# EAGLE design electron_v011 (EAGLE 7.2.0)

## Sheet 1 of 4
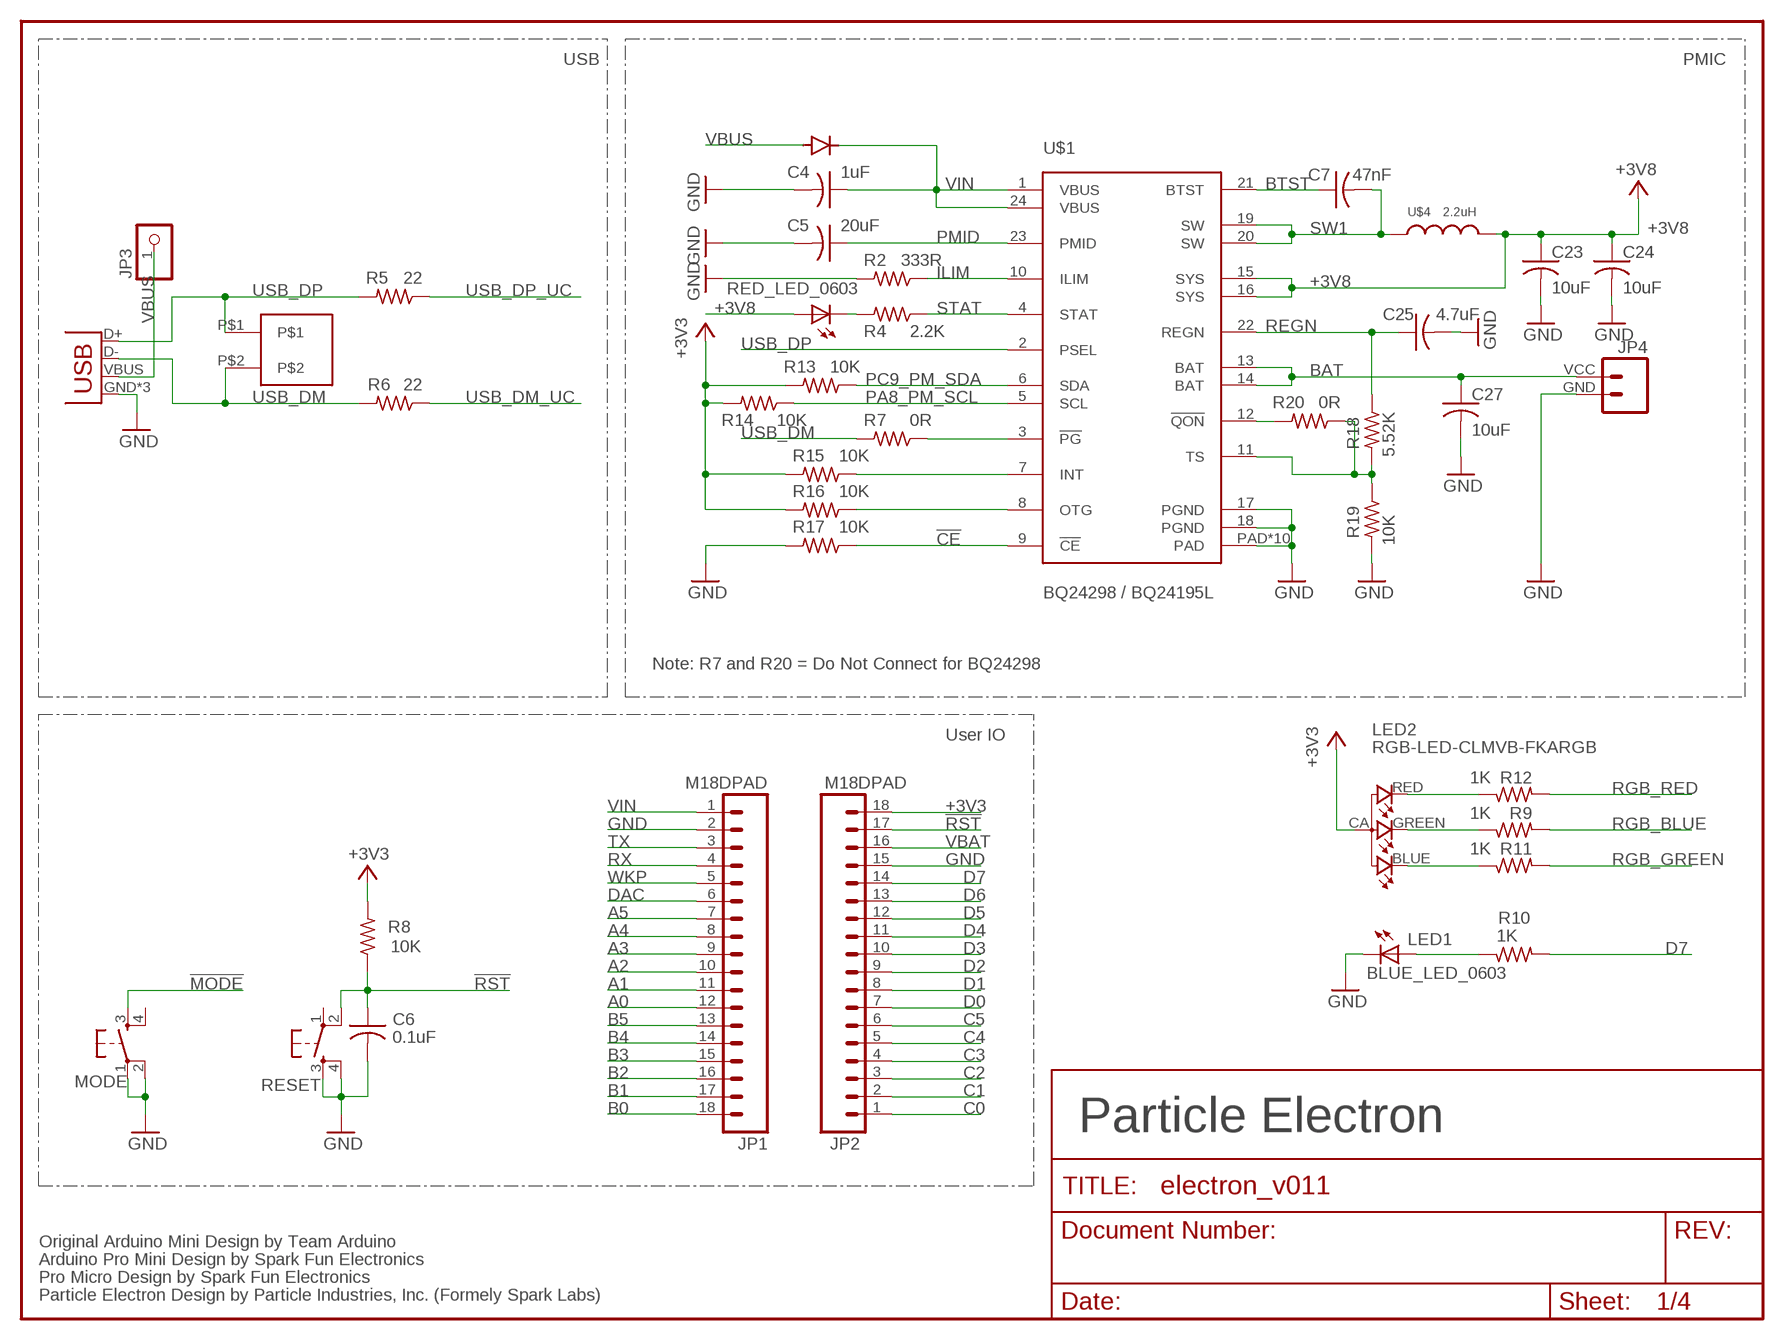
[diagram p0: schematic, sheet 1]

### Parts
BLUE_LED_0603  LED0603  [LED-0603]
C4  1uF  C-US0603  [C0603_B]
C5  20uF  C-US0603  [C0603_B]
C6  0.1uF  C-US  [C0402_B]
C7  47nF  C-US  [C0402_B]
C23  10uF  C-US0603  [C0603_B]
C24  10uF  C-US0603  [C0603_B]
C25  4.7uF  C-US0603  [C0603_B]
C27  10uF  C-US0603  [C0603_B]
JP1  M18DPAD  [1X18-D-PADS]
JP2  M18DPAD  [1X18-D-PADS]
JP3  PINHD-1X1  [1X01]
JP4  M024UCON-15767  [JST-2-SMD-VERT]
LED2  RGB-LED-CLMVB-FKARGB  [PLCC4-2MM-RGB]
MODE  KMR211GLFS  TAC_SWITCHSMD  [TACTILE_SWITCH_SMD]
R2  333R  R-US_  [R0402_B]
R4  2.2K  R-US_  [R0402_B]
R5  22  R-US_  [R0402_B]
R6  22  R-US_  [R0402_B]
R7  0R  R-US_  [R0402_B]
R8  10K  R-US_  [R0402_B]
R9  1K  R-US_  [R0402_B]
R10  1K  R-US_  [R0402_B]
R11  1K  R-US_  [R0402_B]
R12  1K  R-US_  [R0402_B]
R13  10K  R-US_  [R0402_B]
R14  10K  R-US_  [R0402_B]
R15  10K  R-US_  [R0402_B]
R16  10K  R-US_  [R0402_B]
R17  10K  R-US_  [R0402_B]
R18  5.52K  R-US_  [R0402_B]
R19  10K  R-US_  [R0402_B]
R20  0R  R-US_  [R0402_B]
RED_LED_0603  LED0603  [LED-0603]
RESET  KMR211GLFS  TAC_SWITCHSMD  [TACTILE_SWITCH_SMD]
U$1  BQ24298 / BQ24195L  BQ24298RTWR  [QFN24]
U$3  DIODE  [DIODE-DO-220AA(SMP)]
U$4  2.2uH  INDUCTORH  [INDUCTOR-4020]
U$7  M02_0.05_HEADER  [M02_0.05_HEADER]
X1  USB-MICROB  USBUSB-MICROB-SLOT-HOLE  [USB-MICROB-SLOT-HOLE]

### Nets
!CE: R17.1 U$1.9(!CE)
!MODE: MODE.3 ; also sheet 2
!RST: C6.1 JP2.17 R8.1 RESET.2 ; also sheet 2
+3V3: JP2.18 LED2.CA R8.2 R13.2 R14.2 R15.2 R16.2 ; also sheet 2,3,4
+3V8: C23.1 C24.1 RED_LED_0603.A U$1.15(SYS) U$1.16(SYS) U$4.P$2 ; also sheet 3,4
A0: JP1.12 ; also sheet 2
A1: JP1.11 ; also sheet 2
A2: JP1.10 ; also sheet 2
A3: JP1.9 ; also sheet 2
A4: JP1.8 ; also sheet 2
A5: JP1.7 ; also sheet 2
B0: JP1.18 ; also sheet 2
B1: JP1.17 ; also sheet 2
B2: JP1.16 ; also sheet 2
B3: JP1.15 ; also sheet 2
B4: JP1.14 ; also sheet 2
B5: JP1.13 ; also sheet 2
BAT [BAT]: C27.1 JP4.VCC U$1.13(BAT) U$1.14(BAT) ; also sheet 4
BTST: C7.1 U$1.21(BTST)
C0: JP2.1 ; also sheet 2
C1: JP2.2 ; also sheet 2
C2: JP2.3 ; also sheet 2
C3: JP2.4 ; also sheet 2
C4: JP2.5 ; also sheet 2
C5: JP2.6 ; also sheet 2
D0: JP2.7 ; also sheet 2
D1: JP2.8 ; also sheet 2
D2: JP2.9 ; also sheet 2
D3: JP2.10 ; also sheet 2
D4: JP2.11 ; also sheet 2
D5: JP2.12 ; also sheet 2
D6: JP2.13 ; also sheet 2
D7: JP2.14 R10.2 ; also sheet 2
DAC: JP1.6 ; also sheet 2
GND: BLUE_LED_0603.C C4.2 C5.2 C6.2 C23.2 C24.2 C25.2 C27.2 JP1.2 JP2.15 JP4.GND MODE.1 MODE.2 R2.2 R17.2 R19.2 RESET.3 RESET.4 U$1.17(PGND) U$1.18(PGND) U$1.PAD U$1.PAD@1(PAD) U$1.PAD@2(PAD) U$1.PAD@3(PAD) U$1.PAD@4(PAD) U$1.PAD@5(PAD) U$1.PAD@6(PAD) U$1.PAD@7(PAD) U$1.PAD@8(PAD) U$1.PAD@9(PAD) X1.GND X1.MT1(GND) X1.MT2(GND) ; also sheet 2,3,4
ILIM: R2.1 U$1.10(ILIM)
LED1: BLUE_LED_0603.A R10.1
N$1: R20.2 U$1.12(!QON)
N$2: R7.1 U$1.3(!PG)
N$6: R4.2 RED_LED_0603.C
N$7: R16.1 U$1.8(OTG)
N$9: R15.1 U$1.7(INT)
N$27: LED2.BLUE R11.1
N$29: LED2.GREEN R9.1
N$54: LED2.RED R12.1
PA8_PM_SCL: R14.1 U$1.5(SCL) ; also sheet 2,4
PC9_PM_SDA: R13.1 U$1.6(SDA) ; also sheet 2,4
PMID: C5.1 U$1.23(PMID)
REGN: C25.1 R18.1 U$1.22(REGN)
RGB_BLUE: R11.2 ; also sheet 2
RGB_GREEN: R9.2 ; also sheet 2
RGB_RED: R12.2 ; also sheet 2
RX: JP1.4 ; also sheet 2
STAT: R4.1 U$1.4(STAT)
SW1: C7.2 U$1.19(SW) U$1.20(SW) U$4.P$1
TS: R18.2 R19.1 R20.1 U$1.11(TS)
TX: JP1.3 ; also sheet 2
USB_DM: R6.2 R7.2 U$7.P$2 X1.D-
USB_DM_UC: R6.1 ; also sheet 2
USB_DP: R5.2 U$1.2(PSEL) U$7.P$1 X1.D+
USB_DP_UC: R5.1 ; also sheet 2
VBAT: JP2.16 ; also sheet 2
VBUS: JP3.1 U$3.ANODE X1.VBUS
VIN [vcc]: C4.1 JP1.1 U$1.1(VBUS) U$1.24(VBUS) U$3.CATHODE
WKP: JP1.5 ; also sheet 2
Unconnected: MODE.4 RESET.1

### Notes on the sheet
- USB | PMIC
- Note: R7 and R20 = Do Not Connect for BQ24298
- User IO
- Particle Electron
- Original Arduino Mini Design by Team Arduino
- Arduino Pro Mini Design by Spark Fun Electronics
- Pro Micro Design by Spark Fun Electronics
- Particle Electron Design by Particle Industries, Inc. (Formely Spark Labs)

## Sheet 2 of 4
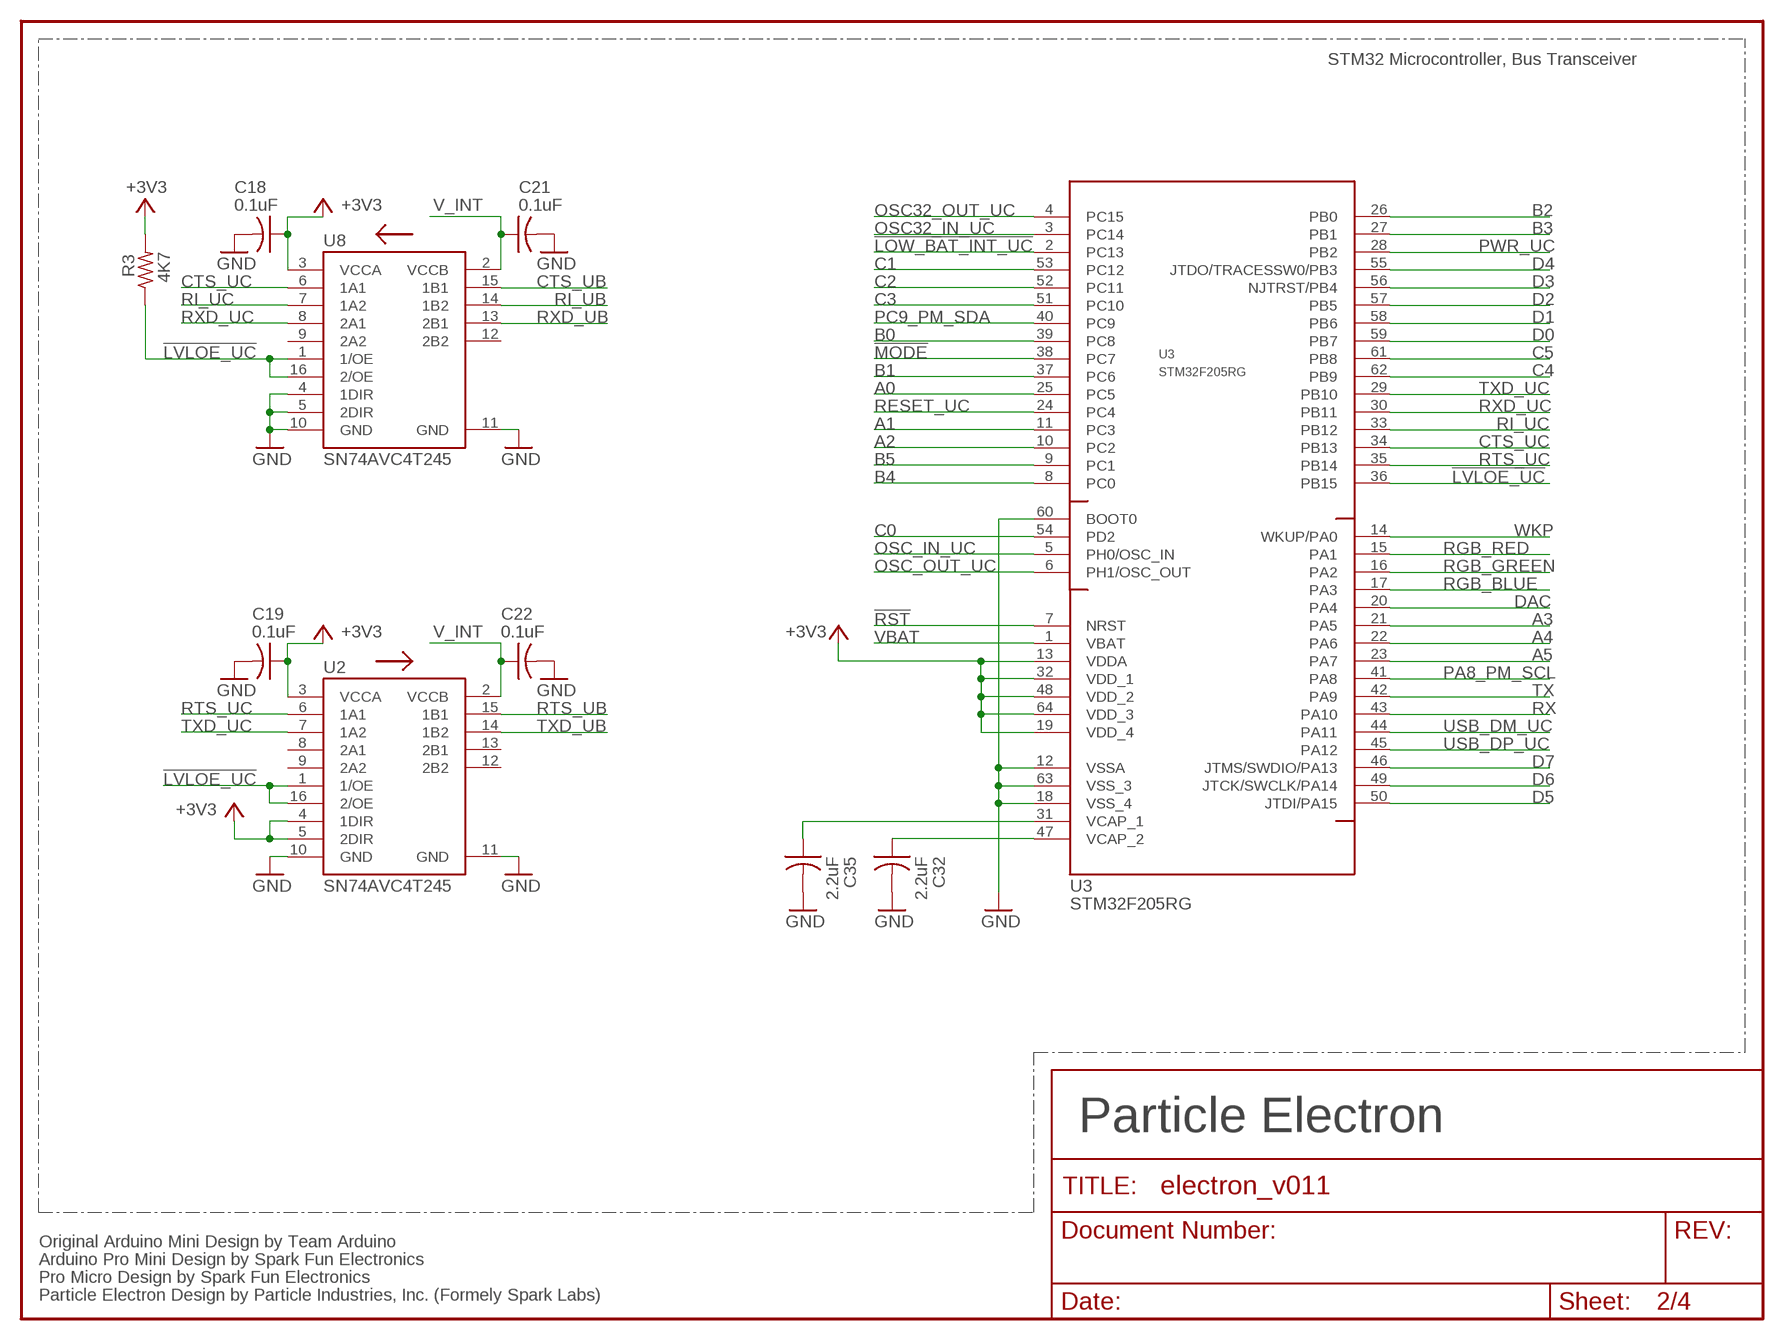
[diagram p1: schematic, sheet 2]

### Parts
C18  0.1uF  C-US  [C0402_B]
C19  0.1uF  C-US  [C0402_B]
C21  0.1uF  C-US  [C0402_B]
C22  0.1uF  C-US  [C0402_B]
C32  2.2uF  C-US  [C0402_B]
C35  2.2uF  C-US  [C0402_B]
R3  4K7  R-US_  [R0402_B]
U2  SN74AVC4T245  [UFQFN-16]
U3  STM32F205RG  STM32F20XR  [LQFP64]
U8  SN74AVC4T245  [UFQFN-16]

### Nets
!LOW_BAT_INT_UC: U3.2(PC13) ; also sheet 4
!LVLOE_UC: R3.1 U2.1(1/OE) U2.16(2/OE) U3.36(PB15) U8.1(1/OE) U8.16(2/OE)
!MODE: U3.38(PC7) ; also sheet 1
!RST: U3.7(NRST) ; also sheet 1
+3V3: C18.1 C19.1 R3.2 U2.3(VCCA) U2.4(1DIR) U2.5(2DIR) U3.13(VDDA) U3.19(VDD_4) U3.32(VDD_1) U3.48(VDD_2) U3.64(VDD_3) U8.3(VCCA) ; also sheet 1,3,4
A0: U3.25(PC5) ; also sheet 1
A1: U3.11(PC3) ; also sheet 1
A2: U3.10(PC2) ; also sheet 1
A3: U3.21(PA5) ; also sheet 1
A4: U3.22(PA6) ; also sheet 1
A5: U3.23(PA7) ; also sheet 1
B0: U3.39(PC8) ; also sheet 1
B1: U3.37(PC6) ; also sheet 1
B2: U3.26(PB0) ; also sheet 1
B3: U3.27(PB1) ; also sheet 1
B4: U3.8(PC0) ; also sheet 1
B5: U3.9(PC1) ; also sheet 1
C0: U3.54(PD2) ; also sheet 1
C1: U3.53(PC12) ; also sheet 1
C2: U3.52(PC11) ; also sheet 1
C3: U3.51(PC10) ; also sheet 1
C4: U3.62(PB9) ; also sheet 1
C5: U3.61(PB8) ; also sheet 1
CTS_UB: U8.15(1B1) ; also sheet 3
CTS_UC: U3.34(PB13) U8.6(1A1)
D0: U3.59(PB7) ; also sheet 1
D1: U3.58(PB6) ; also sheet 1
D2: U3.57(PB5) ; also sheet 1
D3: U3.56(NJTRST/PB4) ; also sheet 1
D4: U3.55(JTDO/TRACESSW0/PB3) ; also sheet 1
D5: U3.50(JTDI/PA15) ; also sheet 1
D6: U3.49(JTCK/SWCLK/PA14) ; also sheet 1
D7: U3.46(JTMS/SWDIO/PA13) ; also sheet 1
DAC: U3.20(PA4) ; also sheet 1
GND: C18.2 C19.2 C21.2 C22.2 C32.2 C35.2 U2.10(GND) U2.11(GND) U3.12(VSSA) U3.18(VSS_4) U3.60(BOOT0) U3.63(VSS_3) U8.4(1DIR) U8.5(2DIR) U8.10(GND) U8.11(GND) ; also sheet 1,3,4
N$15: C35.1 U3.31(VCAP_1)
N$16: C32.1 U3.47(VCAP_2)
OSC32_IN_UC: U3.3(PC14) ; also sheet 4
OSC32_OUT_UC: U3.4(PC15) ; also sheet 4
OSC_IN_UC: U3.5(PH0/OSC_IN) ; also sheet 4
OSC_OUT_UC: U3.6(PH1/OSC_OUT) ; also sheet 4
PA8_PM_SCL: U3.41(PA8) ; also sheet 1,4
PC9_PM_SDA: U3.40(PC9) ; also sheet 1,4
PWR_UC: U3.28(PB2) ; also sheet 3
RESET_UC: U3.24(PC4) ; also sheet 3
RGB_BLUE: U3.17(PA3) ; also sheet 1
RGB_GREEN: U3.16(PA2) ; also sheet 1
RGB_RED: U3.15(PA1) ; also sheet 1
RI_UB: U8.14(1B2) ; also sheet 3
RI_UC: U3.33(PB12) U8.7(1A2)
RTS_UB: U2.15(1B1) ; also sheet 3
RTS_UC: U2.6(1A1) U3.35(PB14)
RX: U3.43(PA10) ; also sheet 1
RXD_UB: U8.13(2B1) ; also sheet 3
RXD_UC: U3.30(PB11) U8.8(2A1)
TX: U3.42(PA9) ; also sheet 1
TXD_UB: U2.14(1B2) ; also sheet 3
TXD_UC: U2.7(1A2) U3.29(PB10)
USB_DM_UC: U3.44(PA11) ; also sheet 1
USB_DP_UC: U3.45(PA12) ; also sheet 1
V_INT: C21.1 C22.1 U2.2(VCCB) U8.2(VCCB) ; also sheet 3
VBAT: U3.1(VBAT) ; also sheet 1
WKP: U3.14(WKUP/PA0) ; also sheet 1
Unconnected: U2.8(2A1) U2.9(2A2) U2.12(2B2) U2.13(2B1) U8.9(2A2) U8.12(2B2)

### Notes on the sheet
- STM32 Microcontroller, Bus Transceiver
- Particle Electron
- Original Arduino Mini Design by Team Arduino
- Arduino Pro Mini Design by Spark Fun Electronics
- Pro Micro Design by Spark Fun Electronics
- Particle Electron Design by Particle Industries, Inc. (Formely Spark Labs)

## Sheet 3 of 4
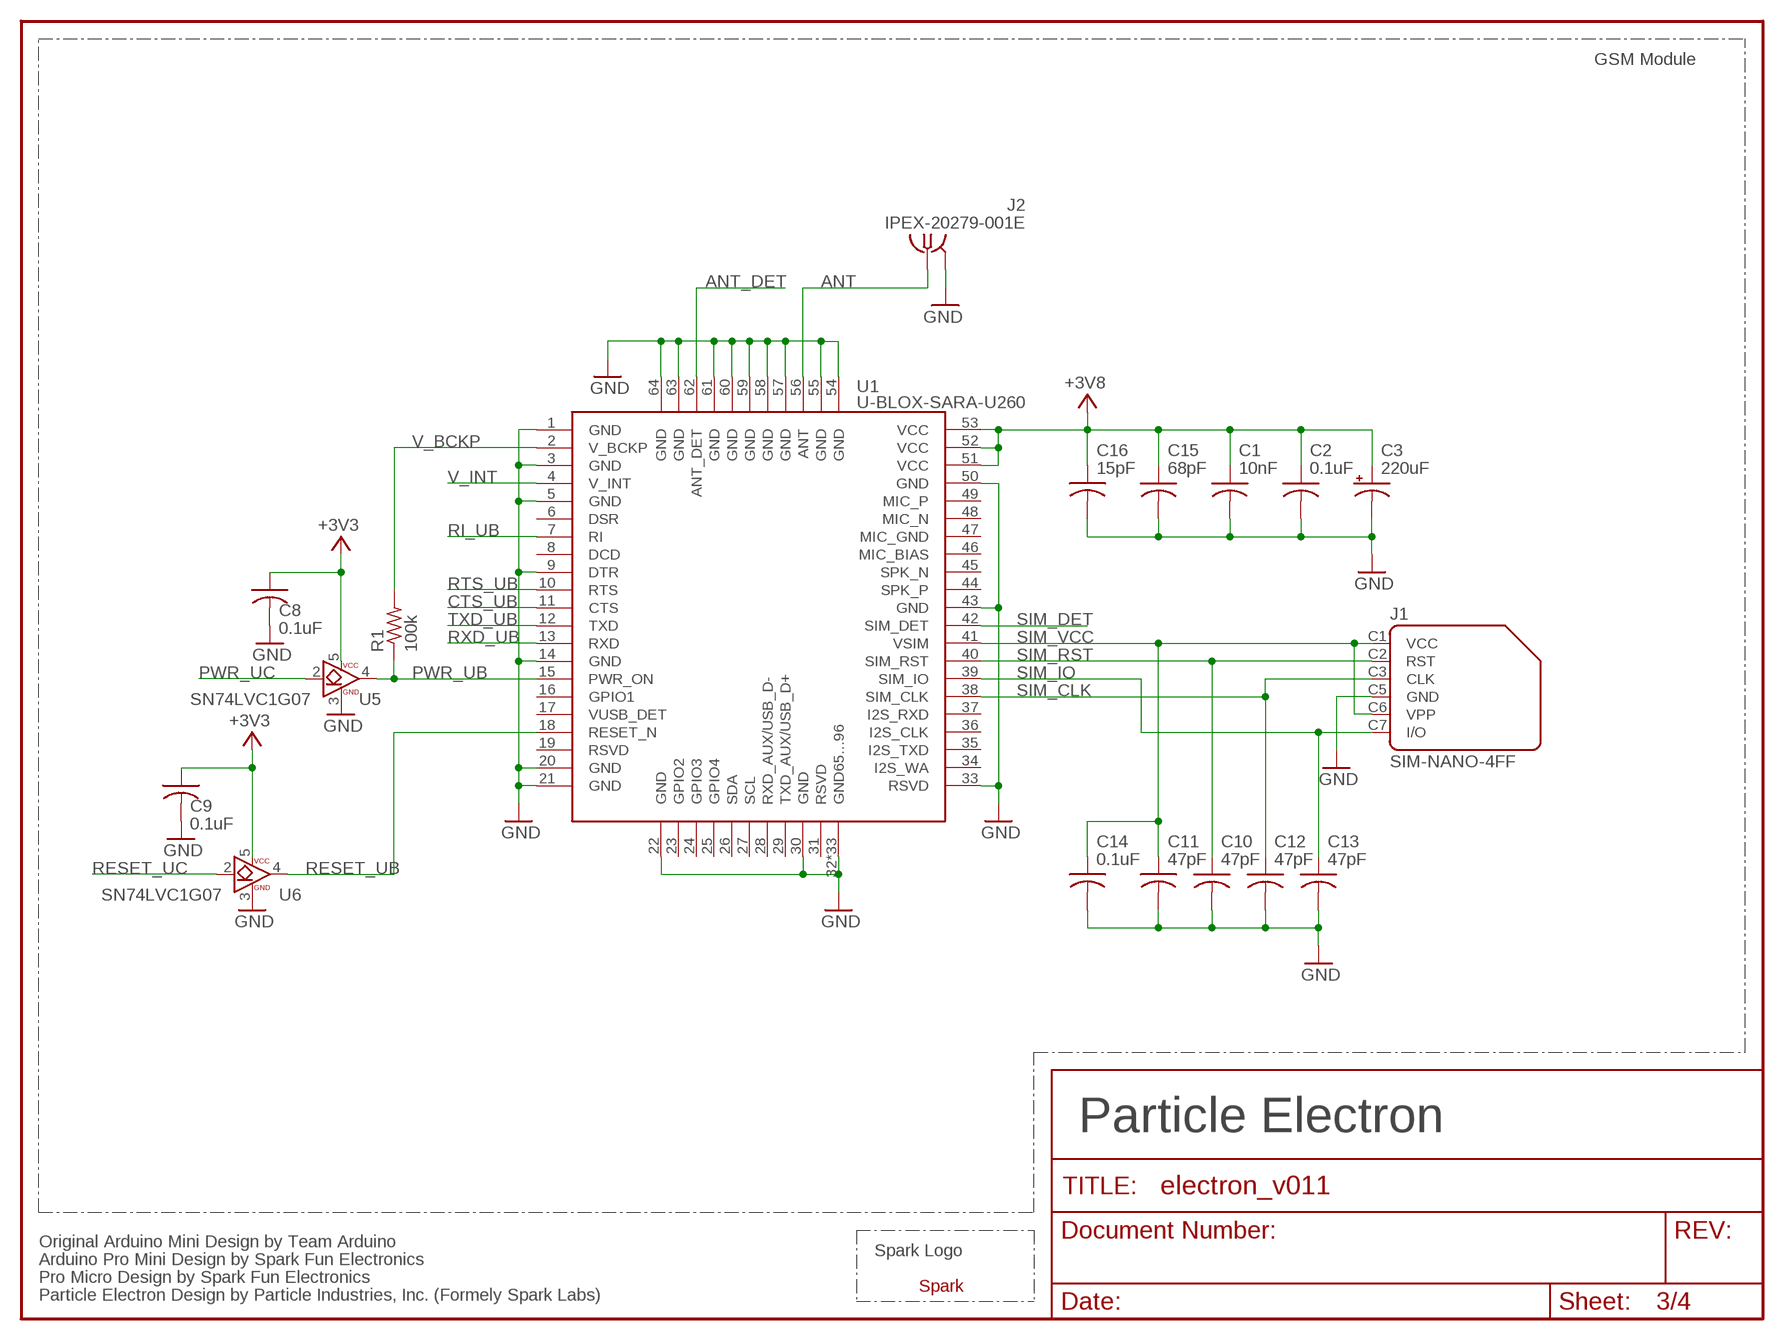
[diagram p2: schematic, sheet 3]

### Parts
C1  10nF  C-US  [C0402_B]
C2  0.1uF  C-US  [C0402_B]
C3  220uF  CPOL-USC/6032-28R  [C/6032-28R]
C8  0.1uF  C-US  [C0402_B]
C9  0.1uF  C-US  [C0402_B]
C10  47pF  C-US  [C0402_B]
C11  47pF  C-US  [C0402_B]
C12  47pF  C-US  [C0402_B]
C13  47pF  C-US  [C0402_B]
C14  0.1uF  C-US  [C0402_B]
C15  68pF  C-US  [C0402_B]
C16  15pF  C-US  [C0402_B]
J1  SIM-NANO-4FF  [GCT-SIM8100]
J2  IPEX-20279-001E  [IPEX-20279-001E]
R1  100k  R-US_  [R0402_B]
U1  U-BLOX-SARA-U260  [U-BLOX-SARA-U2]
U5  SN74LVC1G07  [SC-70-5]
U6  SN74LVC1G07  [SC-70-5]
U$2  SPARK_LOGO2  [SPARK_LOGO2]

### Nets
+3V3: C8.1 C9.1 U5.5(VCC) U6.5(VCC) ; also sheet 1,2,4
+3V8: C1.1 C2.1 C3.+ C15.1 C16.1 U1.51(VCC) U1.52(VCC) U1.53(VCC) ; also sheet 1,4
ANT [RF]: J2.1 U1.56(ANT)
ANT_DET: U1.62(ANT_DET)
CTS_UB: U1.11(CTS) ; also sheet 2
GND: C1.2 C2.2 C3.- C8.2 C9.2 C10.2 C11.2 C12.2 C13.2 C14.2 C15.2 C16.2 J1.C5(GND) J2.2@1(GND) J2.2@2(GND) U1.1(GND) U1.3(GND) U1.5(GND) U1.9(DTR) U1.14(GND) U1.20(GND) U1.21(GND) U1.22(GND) U1.30(GND) U1.32(GND65...96) U1.33(RSVD) U1.43(GND) U1.50(GND) U1.54(GND) U1.55(GND) U1.57(GND) U1.58(GND) U1.59(GND) U1.60(GND) U1.61(GND) U1.63(GND) U1.64(GND) U1.65(GND65...96) U1.66(GND65...96) U1.67(GND65...96) U1.68(GND65...96) U1.69(GND65...96) U1.70(GND65...96) U1.71(GND65...96) U1.72(GND65...96) U1.73(GND65...96) U1.74(GND65...96) U1.75(GND65...96) U1.76(GND65...96) U1.77(GND65...96) U1.78(GND65...96) U1.79(GND65...96) U1.80(GND65...96) U1.81(GND65...96) U1.82(GND65...96) U1.83(GND65...96) U1.84(GND65...96) U1.85(GND65...96) U1.86(GND65...96) U1.87(GND65...96) U1.88(GND65...96) U1.89(GND65...96) U1.90(GND65...96) U1.91(GND65...96) U1.92(GND65...96) U1.93(GND65...96) U1.94(GND65...96) U1.95(GND65...96) U1.96(GND65...96) U5.3(GND) U6.3(GND) ; also sheet 1,2,4
PWR_UB: R1.1 U1.15(PWR_ON) U5.4(B)
PWR_UC: U5.2(A) ; also sheet 2
RESET_UB: U1.18(RESET_N) U6.4(B)
RESET_UC: U6.2(A) ; also sheet 2
RI_UB: U1.7(RI) ; also sheet 2
RTS_UB: U1.10(RTS) ; also sheet 2
RXD_UB: U1.13(RXD) ; also sheet 2
SIM_CLK: C12.1 J1.C3(CLK) U1.38(SIM_CLK)
SIM_DET: U1.42(SIM_DET)
SIM_IO: C13.1 J1.C7(I/O) U1.39(SIM_IO)
SIM_RST: C10.1 J1.C2(RST) U1.40(SIM_RST)
SIM_VCC: C11.1 C14.1 J1.C1(VCC) J1.C6(VPP) U1.41(VSIM)
TXD_UB: U1.12(TXD) ; also sheet 2
V_BCKP: R1.2 U1.2(V_BCKP)
V_INT: U1.4(V_INT) ; also sheet 2
Unconnected: U1.6(DSR) U1.8(DCD) U1.16(GPIO1) U1.17(VUSB_DET) U1.19(RSVD) U1.23(GPIO2) U1.24(GPIO3) U1.25(GPIO4) U1.26(SDA) U1.27(SCL) U1.28(RXD_AUX/USB_D-) U1.29(TXD_AUX/USB_D+) U1.31(RSVD) U1.34(I2S_WA) U1.35(I2S_TXD) U1.36(I2S_CLK) U1.37(I2S_RXD) U1.44(SPK_P) U1.45(SPK_N) U1.46(MIC_BIAS) U1.47(MIC_GND) U1.48(MIC_N) U1.49(MIC_P)

### Notes on the sheet
- GSM Module
- Particle Electron
- Original Arduino Mini Design by Team Arduino
- Spark Logo
- Arduino Pro Mini Design by Spark Fun Electronics
- Pro Micro Design by Spark Fun Electronics
- Particle Electron Design by Particle Industries, Inc. (Formely Spark Labs)

## Sheet 4 of 4
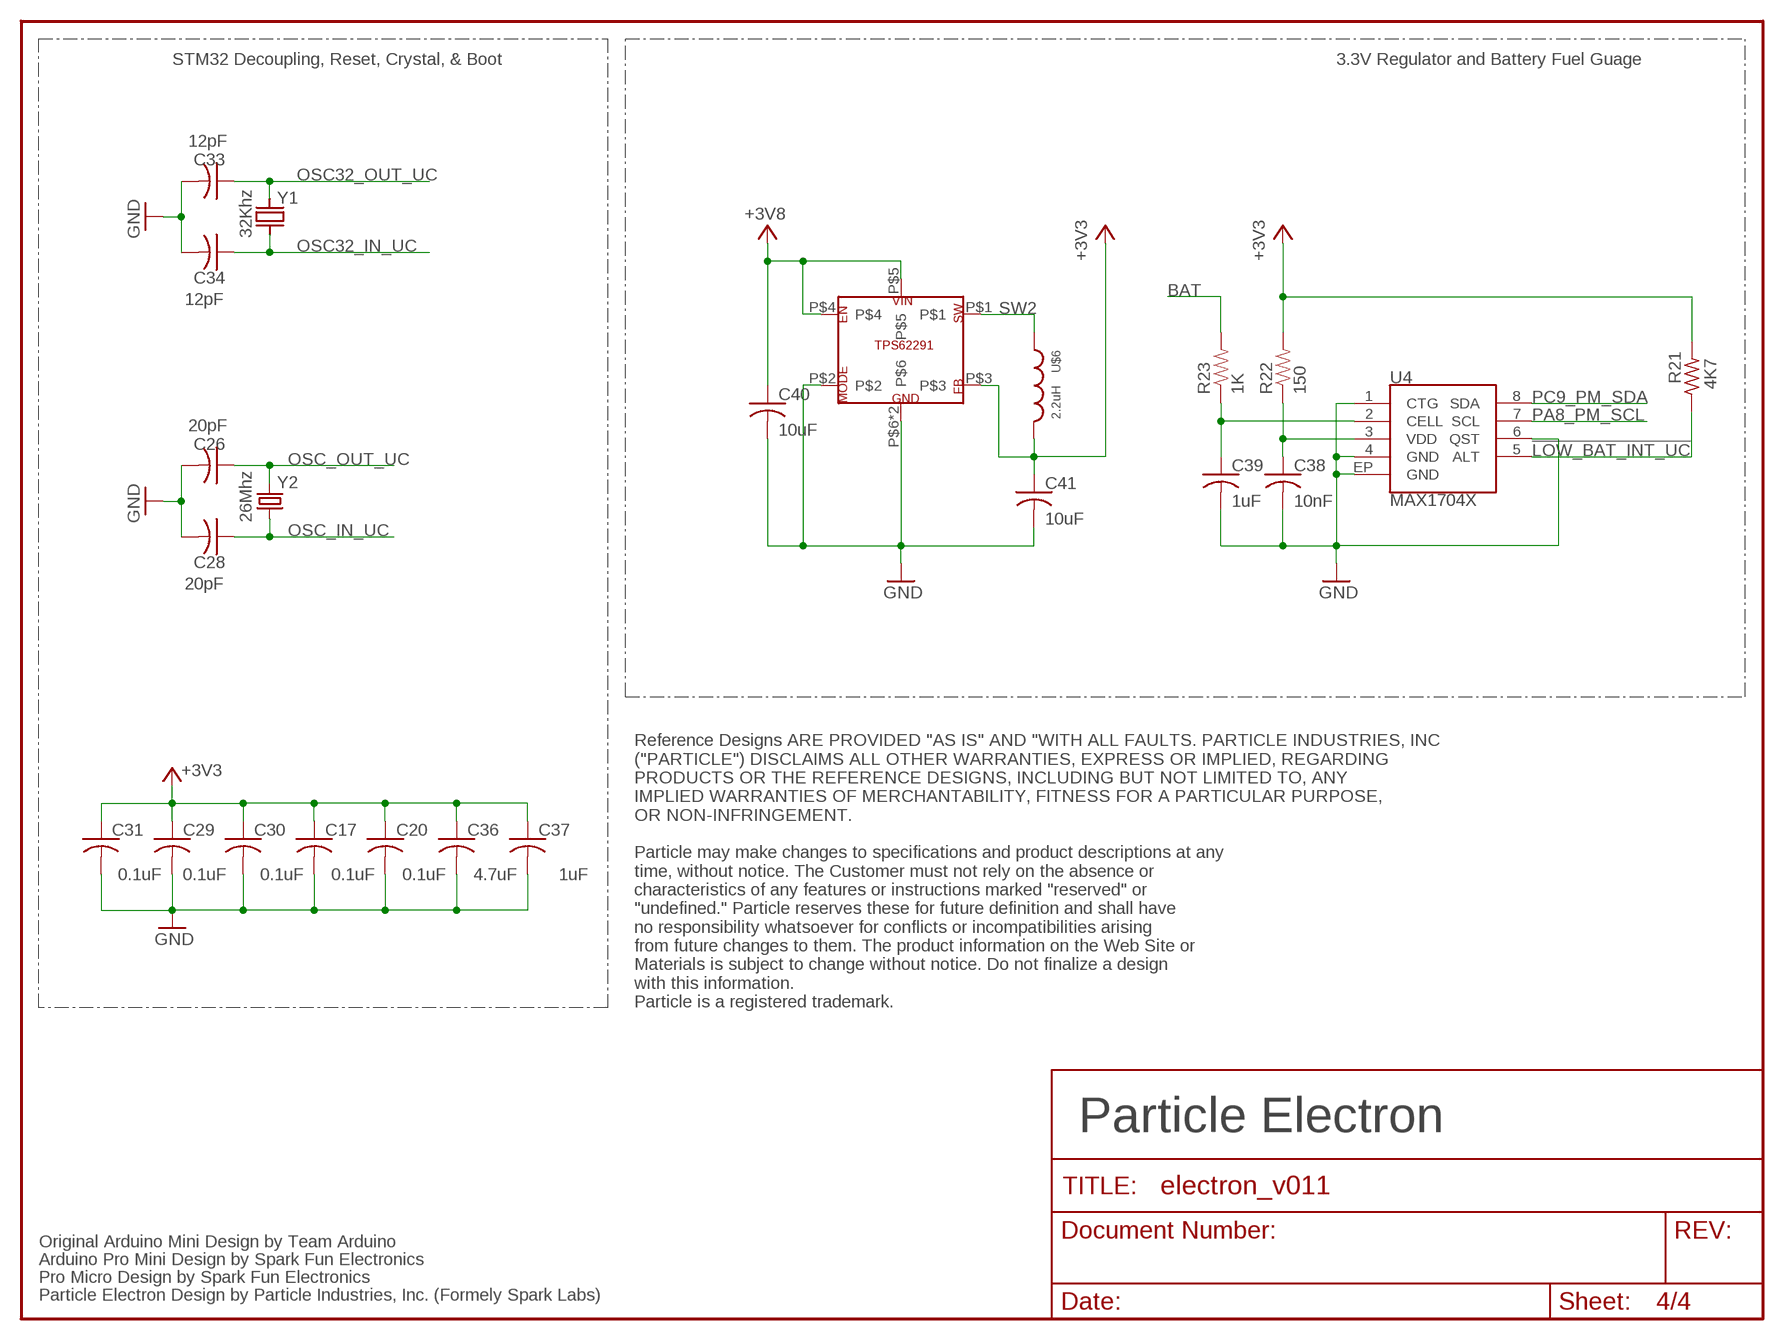
[diagram p3: schematic, sheet 4]

### Parts
C17  0.1uF  C-US  [C0402_B]
C20  0.1uF  C-US  [C0402_B]
C26  20pF  C-US  [C0402_B]
C28  20pF  C-US  [C0402_B]
C29  0.1uF  C-US  [C0402_B]
C30  0.1uF  C-US  [C0402_B]
C31  0.1uF  C-US  [C0402_B]
C33  12pF  C-US  [C0402_B]
C34  12pF  C-US  [C0402_B]
C36  4.7uF  C-US  [C0402_B]
C37  1uF  C-US  [C0402_B]
C38  10nF  C-US  [C0402_B]
C39  1uF  C-US  [C0402_B]
C40  10uF  C-US0603  [C0603_B]
C41  10uF  C-US0603  [C0603_B]
R21  4K7  R-US_  [R0402_B]
R22  150  RESISTOR0603-RES  [0603-RES]
R23  1K  RESISTOR0603-RES  [0603-RES]
U4  MAX1704X  [TDFN-8]
U$5  TPS62291DRV  [S-PWSON-N6]
U$6  2.2uH  INDUCTORH  [INDUCTOR-4020]
Y1  32Khz  Q_FC135  [FC135]
Y2  26Mhz  CRYSTAL5X3  [CRYSTAL-SMD-5X3]

### Nets
!LOW_BAT_INT_UC: R21.1 U4.5(ALT) ; also sheet 2
+3V3: C17.1 C20.1 C29.1 C30.1 C31.1 C36.1 C37.1 C41.1 R21.2 R22.2 U$5.P$3 U$6.P$2 ; also sheet 1,2,3
+3V8: C40.1 U$5.P$4 U$5.P$5 ; also sheet 1,3
BAT [BAT]: R23.2 ; also sheet 1
GND: C17.2 C20.2 C26.2 C28.2 C29.2 C30.2 C31.2 C33.2 C34.2 C36.2 C37.2 C38.2 C39.2 C40.2 C41.2 U4.1(CTG) U4.4(GND) U4.6(QST) U4.EP(GND) U$5.P$2 U$5.P$6 U$5.TP ; also sheet 1,2,3
N$11: C39.1 R23.1 U4.2(CELL)
N$12: C38.1 R22.1 U4.3(VDD)
OSC32_IN_UC: C34.1 Y1.X1 ; also sheet 2
OSC32_OUT_UC: C33.1 Y1.X2 ; also sheet 2
OSC_IN_UC: C28.1 Y2.1 ; also sheet 2
OSC_OUT_UC: C26.1 Y2.3 ; also sheet 2
PA8_PM_SCL: U4.7(SCL) ; also sheet 1,2
PC9_PM_SDA: U4.8(SDA) ; also sheet 1,2
SW2: U$5.P$1 U$6.P$1

### Notes on the sheet
- STM32 Decoupling, Reset, Crystal, & Boot | 3.3V Regulator and Battery Fuel Guage
- Reference Designs ARE PROVIDED "AS IS" AND "WITH ALL FAULTS. PARTICLE INDUSTRIES, INC 
  ("PARTICLE") DISCLAIMS ALL OTHER WARRANTIES, EXPRESS OR IMPLIED, REGARDING 
  PRODUCTS OR THE REFERENCE DESIGNS, INCLUDING BUT NOT LIMITED TO, ANY 
  IMPLIED WARRANTIES OF MERCHANTABILITY, FITNESS FOR A PARTICULAR PURPOSE,
  OR NON-INFRINGEMENT.
  
  Particle may make changes to specifications and product descriptions at any 
  time, without notice. The Customer must not rely on the absence or 
  characteristics of any features or instructions marked "reserved" or 
  "undefined." Particle reserves these for future definition and shall have 
  no responsibility whatsoever for conflicts or incompatibilities arising 
  from future changes to them. The product information on the Web Site or 
  Materials is subject to change without notice. Do not finalize a design 
  with this information. 
  Particle is a registered trademark.
- Particle Electron
- Original Arduino Mini Design by Team Arduino
- Arduino Pro Mini Design by Spark Fun Electronics
- Pro Micro Design by Spark Fun Electronics
- Particle Electron Design by Particle Industries, Inc. (Formely Spark Labs)

## Library data of the parts
BLUE_LED_0603 RED_LED_0603 = SparkFun:LED: LEDs Standard schematic elements and footprints for 5mm, 3mm, 1206, and 0603 sized LEDs. 5mm - Spark Fun Electronics SKU : COM-00529 (and others)
C1 C2 C6-C22 C26 C28-C39 = Spark:C-US: Capacitor
C3 = Bretts-Spark-Library:CPOL-US: POLARIZED CAPACITOR, American symbol
C4 C5 C23-C25 C27 C40 C41 = Bretts-Spark-Library:C-US: Capacitor
J1 = Bretts-Spark-Library:SIM-NANO-4FF: SIM NANO 4FF
J2 = Spark:IPEX-20279-001E: Ultra Miniature Coaxial SMT RF Receptacle
JP1 JP2 = Particle:M18
JP3 = Particle:PINHD-1X1: PIN HEADER
JP4 = SparkFun-Connectors:M02: Standard 2-pin 0.1" header. Use with - straight break away headers ( PRT-00116) - right angle break away headers (PRT-00553) - swiss pins (PRT-00743) - machine pins (PRT-00117) - female headers (PRT-00115) Molex polarized connector foot print use with: PRT-08233 with associated crimp pins and housings. 2.54_SCREWTERM for use with PRT-10571. 3.5mm Screw Terminal footprints for PRT-08084 5mm Screw Terminal footprints for use with PRT-08432
LED2 = Spark:RGB-LED-CLMVB-FKA: CREE CLMVB-FKA RGB LED 2mm x 2mm
MODE RESET = Spark:TAC_SWITCH: SMD Tactiile Switch
R1-R21 = Spark:R-US_: 0402 Resistor
R22 R23 = SparkFun-Passives:RESISTOR: Resistor Basic schematic elements and footprints for 0603, 1206, and PTH resistors.
U1 = Bretts-Spark-Library:U-BLOX-SARA-U260
U2 U8 = Bretts-Spark-Library:SN74AVC4T245
U3 = Bretts-Spark-Library:STM32F20XR
U4 = SparkFun-PowerIC:MAX1704X: MAX17043/MAX17044: Battery Fuel Guage (43 is 1cell, 44 is 2cell)
U5 U6 = Bretts-Spark-Library:SN74LVC1G07
U$1 = electron:BQ24298RTWR: Bq24298 I2C Controlled 3A Single Cell USB Charger with Narrow VDC Power Path Management and Adjustable Voltage USB OTG
U$2 = Spark:SPARK_LOGO2
U$3 = Spark:DIODE
U$4 U$6 = Particle:INDUCTOR
U$5 = Particle:TPS62291
U$7 = Particle:M02_0.05_HEADER
X1 = Spark:USB
Y1 = Spark:Q
Y2 = SparkFun-FreqCtrl:CRYSTAL: Various standard crystals. Proven footprints. Spark Fun Electronics SKU : COM-00534

## Net classes
2 RF: width 0.33 mm, clearance 0.191 mm
3 BAT: clearance 0.203 mm

## Board
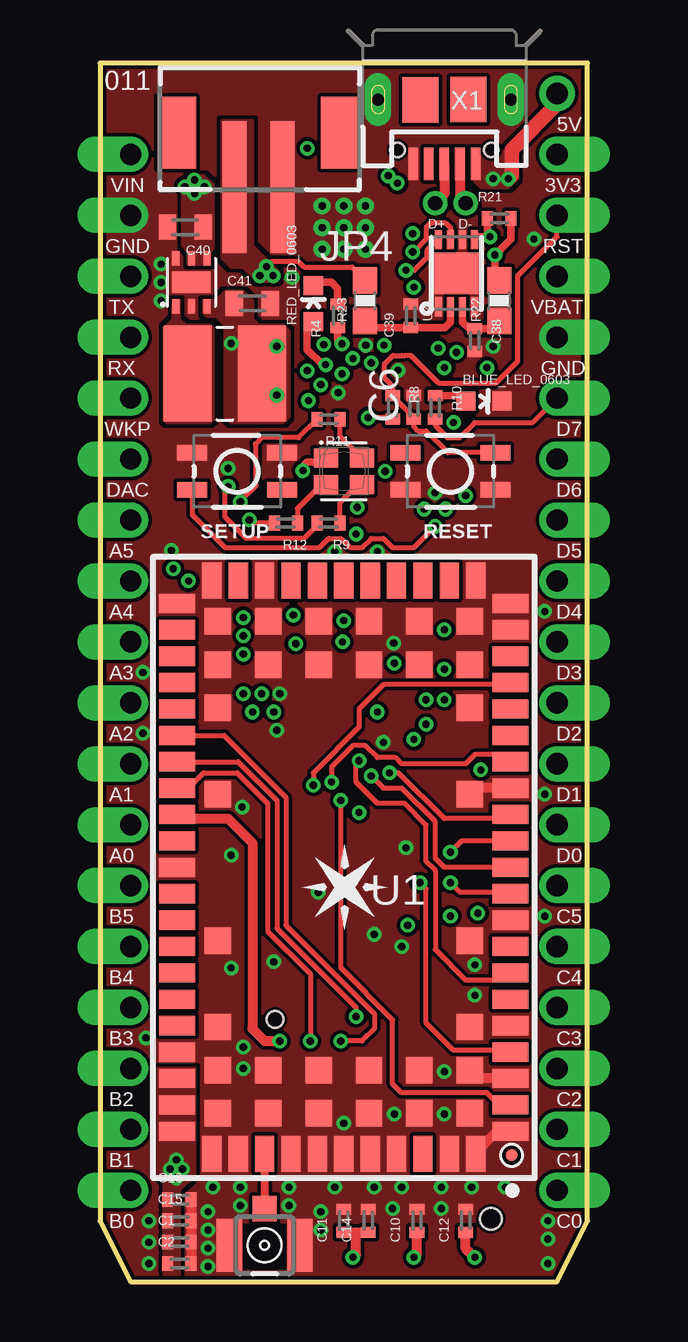
[diagram p4: board, top side]
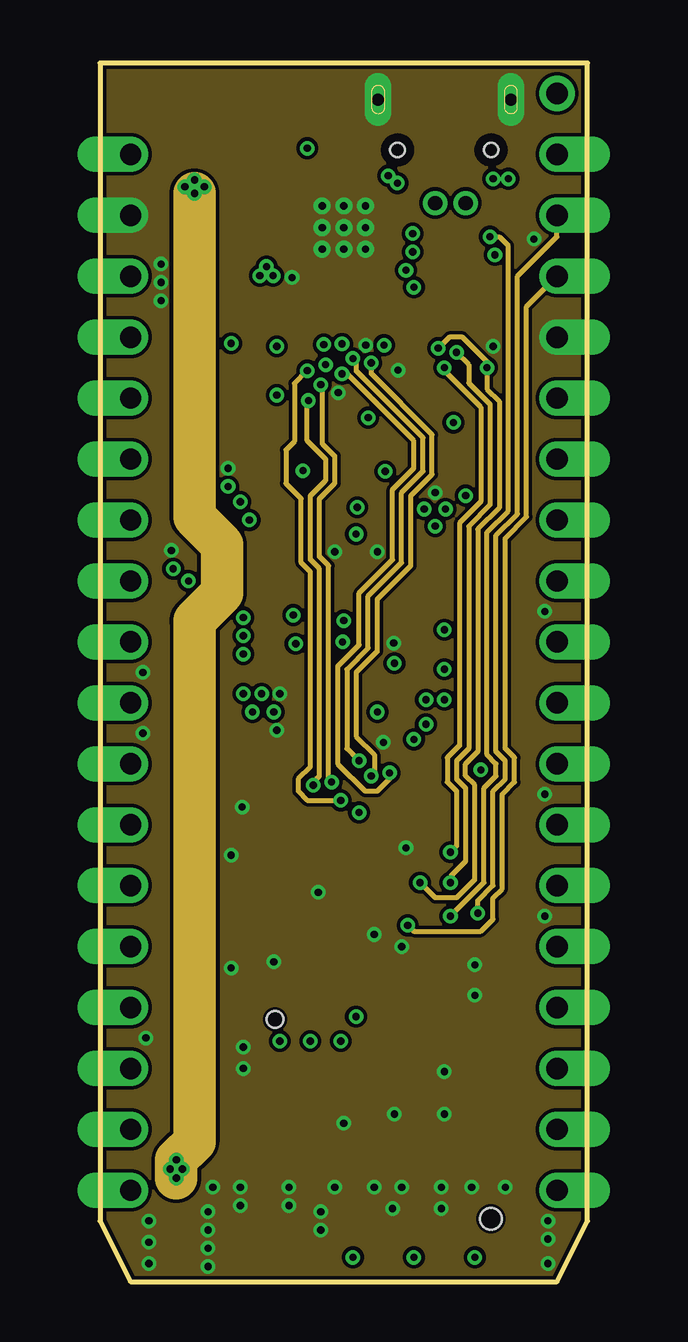
[diagram p5: board, inner layer $GND]
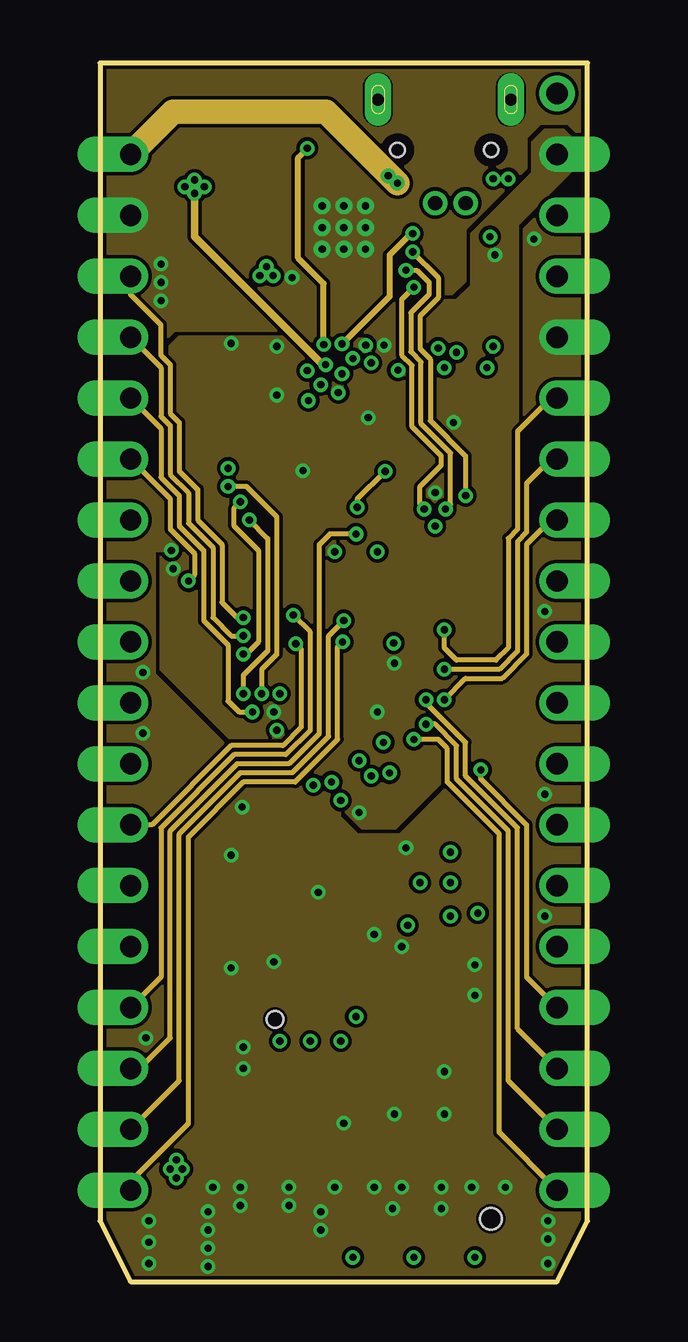
[diagram p6: board, inner layer $+3V3]
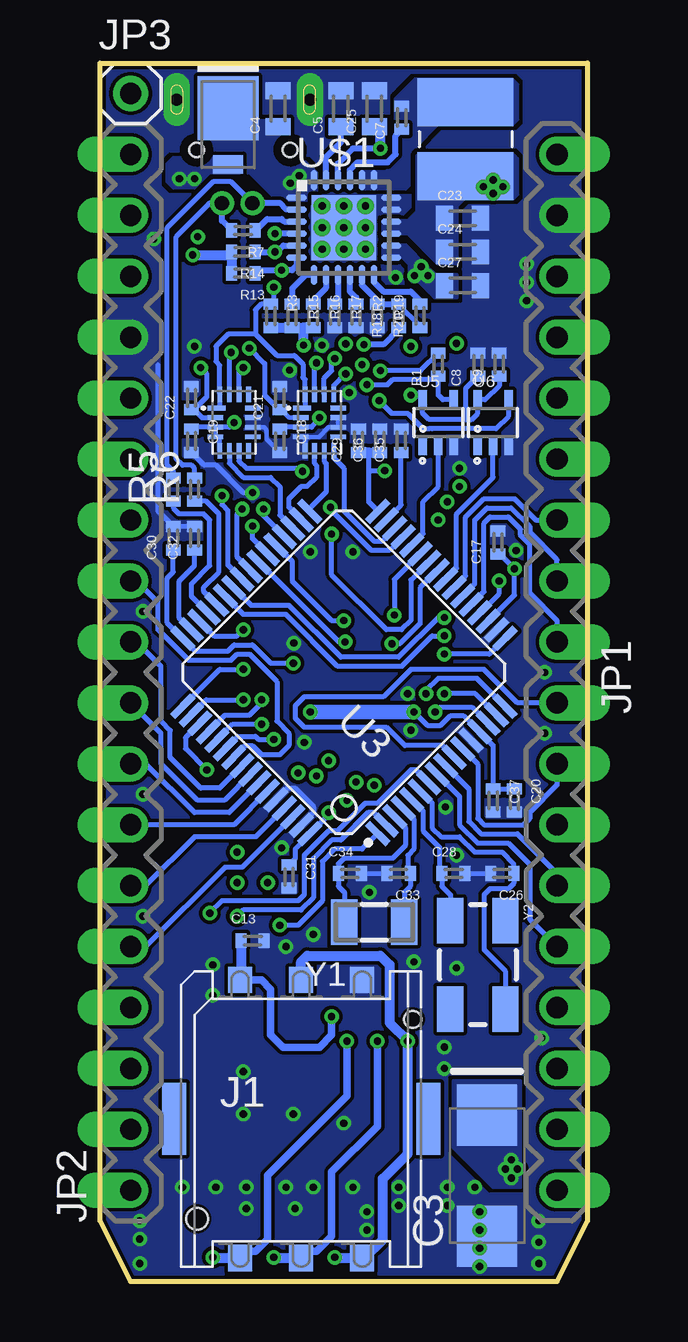
[diagram p7: board, bottom side, seen from below]

Size 20.32 x 50.8 mm. Coordinates in mm from the lower left corner, seen from the top.
Outline: 0,50.8 0,2.54 1.27,0 19.05,0 20.32,2.54 20.32,50.8 0,50.8
Copper layers (1+2*15+16): Top 0.018mm / dielectric 0.195mm / $GND 0.035mm / dielectric 1.1mm / $+3V3 0.035mm / dielectric 0.195mm / Bottom 0.018mm
Design rules "particle-4layer": minimum track width 6mil, minimum drill 0.3mm, track to track 6mil, track to pad 6mil, pad to pad 6mil, via to via 6mil, smd to smd 6mil, copper to edge 6mil, drill to drill 6mil, minimum pad ring 8mil, minimum via ring 6mil, stop-mask expansion 4mil, vias tented up to drill 20mil, thermal gap 8mil

### Footprints (pad centres in the part's own frame; a part is rotated, then mirrored left to right if it is on the bottom)
LED-0603 = smd 0.8 x 0.8: A 0,-0.75; C 0,0.75
C0402_B = smd 0.457 x 0.61: 1 -0.483,0; 2 0.483,0
C/6032-28R = smd 2.55 x 2.5: + 2.525,0; - -2.525,0
C0603_B = smd 0.711 x 1.041: 1 -0.749,0; 2 0.749,0
GCT-SIM8100 = smd 1 x 1.1: C1 2.54,-5.8; C2 0,-5.8; C3 -2.54,-5.8; C5 2.54,5.8; C6 0,5.8; C7 -2.54,5.8 | smd 1 x 3: NC@1 -5.3,0; NC@2 5.3,0 | hole 0.7: 4.65,4.15 | hole 0.9: -4.35,-4.15
IPEX-20279-001E = smd 1 x 1.05: 1 0,1.528 | smd 1.05 x 2.2: 2@1 -1.475,0; 2@2 1.475,0
1X18-D-PADS = drill 0.889 pad 1.473 offset: 1 -21.59,0; 2 -19.05,0; 3 -16.51,0; 4 -13.97,0; 5 -11.43,0; 6 -8.89,0; 7 -6.35,0; 8 -3.81,0; 9 -1.27,0; 10 1.27,0; 11 3.81,0; 12 6.35,0; 13 8.89,0; 14 11.43,0; 15 13.97,0; 16 16.51,0; 17 19.05,0; 18 21.59,0
1X01 = drill 0.889 pad 1.473: 1 0,0
JST-2-SMD-VERT = smd 1 x 5.5: GND 1,-2; VCC -1,-2 | smd 1.6 x 3: P$1 -3.4,0.27; P$2 3.4,0.27
PLCC4-2MM-RGB = smd 1 x 0.8: BLUE -0.75,-0.55; CA 0.75,-0.55; GREEN -0.75,0.55; RED 0.75,0.55
TACTILE_SWITCH_SMD = smd 1.25 x 0.65: 1 -1.875,0.775; 2 1.875,0.775; 3 -1.875,-0.775; 4 1.875,-0.775
R0402_B = smd 0.457 x 0.61: 1 -0.483,0; 2 0.483,0
0603-RES = smd 1.1 x 1: 1 -0.85,0; 2 0.85,0
U-BLOX-SARA-U2 = smd 1.5 x 0.8: 1 -6.95,11; 2 -6.95,9.9; 3 -6.95,8.8; 4 -6.95,7.7; 5 -6.95,6.6; 6 -6.95,5.5; 7 -6.95,4.4; 8 -6.95,3.3; 9 -6.95,2.2; 10 -6.95,1.1; 11 -6.95,0; 12 -6.95,-1.1; 13 -6.95,-2.2; 14 -6.95,-3.3; 15 -6.95,-4.4; 16 -6.95,-5.5; 17 -6.95,-6.6; 18 -6.95,-7.7; 19 -6.95,-8.8; 20 -6.95,-9.9; 21 -6.95,-11; 33 6.95,-11; 34 6.95,-9.9; 35 6.95,-8.8; 36 6.95,-7.7; 37 6.95,-6.6; 38 6.95,-5.5; 39 6.95,-4.4; 40 6.95,-3.3; 41 6.95,-2.2; 42 6.95,-1.1; 43 6.95,0; 44 6.95,1.1; 45 6.95,2.2; 46 6.95,3.3; 47 6.95,4.4; 48 6.95,5.5; 49 6.95,6.6; 50 6.95,7.7; 51 6.95,8.8; 52 6.95,9.9; 53 6.95,11 | smd 0.8 x 1.5: 22 -5.5,-11.95; 23 -4.4,-11.95; 24 -3.3,-11.95; 25 -2.2,-11.95; 26 -1.1,-11.95; 27 0,-11.95; 28 1.1,-11.95; 29 2.2,-11.95; 30 3.3,-11.95; 31 4.4,-11.95; 32 5.5,-11.95; 54 5.5,11.95; 55 4.4,11.95; 56 3.3,11.95; 57 2.2,11.95; 58 1.1,11.95; 59 0,11.95; 60 -1.1,11.95; 61 -2.2,11.95; 62 -3.3,11.95; 63 -4.4,11.95; 64 -5.5,11.95 | smd 1.1 x 1.1: 65 -5.25,10.25; 66 -3.15,10.25; 67 -1.05,10.25; 68 1.05,10.25; 69 3.15,10.25; 70 5.25,10.25; 71 -5.25,8.45; 72 -3.15,8.45; 73 -1.05,8.45; 74 1.05,8.45; 75 3.15,8.45; 76 5.25,8.45; 77 -5.25,6.65; 78 5.25,6.65; 79 -5.25,3.05; 80 5.25,3.05; 81 -5.25,-3.05; 82 5.25,-3.05; 83 -5.25,-6.65; 84 5.25,-6.65; 85 -5.25,-8.45; 86 -3.15,-8.45; 87 -1.05,-8.45; 88 1.05,-8.45; 89 3.15,-8.45; 90 5.25,-8.45; 91 -5.25,-10.25; 92 -3.15,-10.25; 93 -1.05,-10.25; 94 1.05,-10.25; 95 3.15,-10.25; 96 5.25,-10.25 | smd 0.5 x 0.5: FID_PIN1 -7,12
UFQFN-16 = smd 0.2 x 0.75: 1 -0.6,-0.73 | smd 0.2 x 0.65: 2 -0.2,-0.78; 3 0.2,-0.78; 4 0.6,-0.78; 9 0.6,0.78; 10 0.2,0.78; 11 -0.2,0.78; 12 -0.6,0.78 | smd 0.65 x 0.2: 5 1.18,-0.6; 6 1.18,-0.2; 7 1.18,0.2; 8 1.18,0.6; 13 -1.18,0.6; 14 -1.18,0.2; 15 -1.18,-0.2; 16 -1.18,-0.6
LQFP64 = smd 1.2 x 0.3: 1 -5.75,3.75; 2 -5.75,3.25; 3 -5.75,2.75; 4 -5.75,2.25; 5 -5.75,1.75; 6 -5.75,1.25; 7 -5.75,0.75; 8 -5.75,0.25; 9 -5.75,-0.25; 10 -5.75,-0.75; 11 -5.75,-1.25; 12 -5.75,-1.75; 13 -5.75,-2.25; 14 -5.75,-2.75; 15 -5.75,-3.25; 16 -5.75,-3.75; 33 5.75,-3.75; 34 5.75,-3.25; 35 5.75,-2.75; 36 5.75,-2.25; 37 5.75,-1.75; 38 5.75,-1.25; 39 5.75,-0.75; 40 5.75,-0.25; 41 5.75,0.25; 42 5.75,0.75; 43 5.75,1.25; 44 5.75,1.75; 45 5.75,2.25; 46 5.75,2.75; 47 5.75,3.25; 48 5.75,3.75 | smd 0.3 x 1.2: 17 -3.75,-5.75; 18 -3.25,-5.75; 19 -2.75,-5.75; 20 -2.25,-5.75; 21 -1.75,-5.75; 22 -1.25,-5.75; 23 -0.75,-5.75; 24 -0.25,-5.75; 25 0.25,-5.75; 26 0.75,-5.75; 27 1.25,-5.75; 28 1.75,-5.75; 29 2.25,-5.75; 30 2.75,-5.75; 31 3.25,-5.75; 32 3.75,-5.75; 49 3.75,5.75; 50 3.25,5.75; 51 2.75,5.75; 52 2.25,5.75; 53 1.75,5.75; 54 1.25,5.75; 55 0.75,5.75; 56 0.25,5.75; 57 -0.25,5.75; 58 -0.75,5.75; 59 -1.25,5.75; 60 -1.75,5.75; 61 -2.25,5.75; 62 -2.75,5.75; 63 -3.25,5.75; 64 -3.75,5.75
TDFN-8 = smd 0.8 x 0.3: 1 -1.4,0.75; 2 -1.4,0.25; 3 -1.4,-0.25; 4 -1.4,-0.75; 5 1.4,-0.75; 6 1.4,-0.25; 7 1.4,0.25; 8 1.4,0.75 | smd 1.73 x 1.88: EP 0,0
SC-70-5 = smd 0.35 x 0.8: 1 -0.65,-0.95; 2 0,-0.95; 3 0.65,-0.95; 4 0.65,0.95; 5 -0.65,0.95
QFN24 = smd 0.85 x 0.28: 1 -1.975,1.25; 2 -1.975,0.75; 3 -1.975,0.25; 4 -1.975,-0.25; 5 -1.975,-0.75; 6 -1.975,-1.25; 13 1.975,-1.25; 14 1.975,-0.75; 15 1.975,-0.25; 16 1.975,0.25; 17 1.975,0.75; 18 1.975,1.25 | smd 0.28 x 0.85: 7 -1.25,-1.975; 8 -0.75,-1.975; 9 -0.25,-1.975; 10 0.25,-1.975; 11 0.75,-1.975; 12 1.25,-1.975; 19 1.25,1.975; 20 0.75,1.975; 21 0.25,1.975; 22 -0.25,1.975; 23 -0.75,1.975; 24 -1.25,1.975 | smd 2.7 x 2.7: PAD 0,0 | drill 0.3 pad 0.406: PAD@1 -0.9,0.9; PAD@2 0,0.9; PAD@3 0.9,0.9; PAD@4 -0.9,0; PAD@5 0,0; PAD@6 0.9,0; PAD@7 -0.9,-0.9; PAD@8 0,-0.9; PAD@9 0.9,-0.9
DIODE-DO-220AA(SMP) = smd 0.762 x 1.27: ANODE 2.349,0 | smd 2.667 x 2.54: CATHODE 0,0
INDUCTOR-4020 = smd 2 x 4: P$1 -1.55,0; P$2 1.55,0
S-PWSON-N6 = smd 0.3 x 0.6: P$1 -0.65,-1; P$2 0,-1; P$3 0.65,-1; P$4 0.65,1; P$5 0,1; P$6 -0.65,1 | smd 1.6 x 0.9: TP 0,0
M02_0.05_HEADER = drill 0.6 pad 1: P$1 -0.635,0; P$2 0.635,0
USB-MICROB-SLOT-HOLE = smd 0.4 x 1.35: D+ 0,2.675; D- -0.65,2.675; GND 1.3,2.675; ID 0.65,2.675; VBUS -1.3,2.675 | drill 0.5 pad 1.1 long: MT1 -2.775,0; MT2 2.775,0 | smd 1.5 x 1.9: P$1 -1,0; P$2 1,0.01 | hole 0.6: -1.95,2.1; 1.95,2.1
FC135 = smd 1.1 x 1.9: X1 -1.25,0; X2 1.25,0
CRYSTAL-SMD-5X3 = smd 1.9 x 1.1: 1 -1.85,-1.15; 2 1.85,-1.15; 3 1.85,1.15; 4 -1.85,1.15

### Placement (x,y rotation side)
BLUE_LED_0603  16,36.7 270 top
C1  3.3,1.65 0 top
C2  3.3,0.76 0 top
C3  4.19,4.42 90 bottom
C4  12.9,48.9 90 bottom
C5  10.29,48.9 90 bottom
C6  13.08,36.45 90 top
C7  7.75,48.51 90 bottom
C8  4.57,38.23 90 bottom
C9  3.68,38.23 90 bottom
C10  13.21,2.54 90 top
C11  10.16,2.54 90 top
C12  15.24,2.54 90 top
C13  13.97,14.22 0 bottom
C14  11.18,2.54 90 top
C15  3.3,2.54 0 top
C16  3.3,3.43 0 top
C17  3.73,30.81 90 bottom
C18  12.83,35.05 270 bottom
C19  16.51,35.05 270 bottom
C20  3.05,20.07 270 bottom
C21  12.83,36.83 90 bottom
C22  16.51,36.83 90 bottom
C23  5.21,44.32 0 bottom
C24  5.21,42.93 0 bottom
C25  8.89,48.9 90 bottom
C26  3.56,17.02 180 bottom
C27  5.21,41.53 0 bottom
C28  5.59,17.02 0 bottom
C29  9.55,35.05 90 bottom
C30  17.27,30.99 90 bottom
C31  12.45,16.89 270 bottom
C32  16.38,30.99 90 bottom
C33  7.87,17.02 180 bottom
C34  9.91,17.02 0 bottom
C35  7.77,35.05 90 bottom
C36  8.66,35.05 90 bottom
C37  3.94,20.07 270 bottom
C38  15.62,39.24 270 top
C39  12.95,40.26 90 top
C40  3.55,43.95 180 top
C41  6.34,40.77 0 top
J1  11.94,6.78 0 bottom
J2  6.86,1.52 0 top
JP1  1.27,25.4 270 bottom
JP2  19.05,25.4 90 bottom
JP3  19.05,49.53 0 bottom
JP4  6.6,47.62 0 top
LED2  10.16,33.78 180 top
MODE  5.71,33.78 0 top
R1  6.22,38.23 90 bottom
R2  9.65,40.26 270 bottom
R3  13.21,40.26 270 bottom
R4  9.91,40.26 90 top
R5  17.27,33.02 90 bottom
R6  16.38,33.02 90 bottom
R7  14.35,43.81 180 bottom
R8  12.19,36.45 270 top
R9  9.53,31.62 180 top
R10  13.97,36.45 270 top
R11  9.53,35.94 180 top
R12  7.75,31.62 180 top
R13  14.35,42.04 180 bottom
R14  14.35,42.93 180 bottom
R15  12.32,40.26 270 bottom
R16  11.43,40.26 270 bottom
R17  10.54,40.26 270 bottom
R18  7.87,40.26 90 bottom
R19  8.76,40.26 270 bottom
R20  6.99,40.26 90 bottom
R21  16.64,44.32 0 top
R22  16.64,40.89 90 top
R23  11.05,40.89 90 top
RED_LED_0603  8.89,40.77 0 top
RESET  14.61,33.78 0 top
U1  10.16,17.27 180 top
U2  14.73,35.81 270 bottom
U3  10.16,25.4 135 bottom
U4  14.86,42.04 90 top
U5  6.22,35.81 0 bottom
U6  3.94,35.81 0 bottom
U8  11.18,35.81 270 bottom
U$1  10.16,43.94 0 bottom
U$2  16.33,0.25 0 top
U$3  14.99,48.92 270 bottom
U$4  5.08,47.62 270 bottom
U$5  3.81,41.66 0 top
U$6  5.2,37.85 0 top
U$7  14.61,44.96 0 top
X1  14.35,49.28 180 top
Y1  8.89,14.99 0 bottom
Y2  4.57,13.21 270 bottom

### Tracks (layer width: path | path; a pad name or v marks a point on that pad's centre or on a via)
!CE
  Bottom 0.254: U$1.9 10.41,40.87 R17.1
!LOW_BAT_INT_UC  (via drill 0.3)
  Top 0.305: U4.5 15.61,43.56 v16.26,43.56 16.15,43.66 R21.1
  $GND 0.203: v14.61,15.24 16,16.64 16,20.57 16.51,21.08 16.51,21.59 16.13,21.97 16.13,31.24 17.02,32.13 17.02,43.18 16.64,43.56 v16.26,43.56
  Bottom 0.203: U3.2 8.91,19.56 9.14,19.56 10.29,18.41 10.67,18.41 11.43,17.65 11.43,16 11.94,15.49 14.35,15.49 v14.61,15.24
!LVLOE_UC  (via drill 0.3)
  $+3V3 0.203: v13.51,32.21 13.34,32.38 13.34,33.15 14.22,34.04 14.22,34.42 13.01,35.64 13.01,38.2 12.57,38.63 12.57,40.95 v13.08,41.45
  Bottom 0.203: U8.1 11.78,36.41 U8.16 11.78,37.61 11.86,37.69 11.86,38.25 12.22,38.61 12.95,38.61 13.84,39.5 | U2.1 15.33,36.41 U2.16 15.33,38.19 15.49,38.35 15.49,38.99 14.99,39.5 13.84,39.5 | 13.84,39.5 13.84,40.51 13.61,40.74 R3.1 13.08,40.87 v13.08,41.45 | v13.51,32.21 13.51,31.93 U3.36
!MODE  (via drill 0.3)
  Top 0.203: MODE.3 3.84,31.97 5.21,30.61 9.14,30.61 9.53,30.99 10.03,30.99 10.41,30.61 10.92,30.61 11.3,30.99 11.81,30.99 12.19,30.61 13.08,30.61 v13.97,31.5
  Bottom 0.203: U3.38 13.97,30.98 v13.97,31.5
!RST  (via drill 0.3)
  Top 0.203: RESET.2 14.49,34.56 13.59,35.46 13.26,35.46 13.08,35.64 C6.1 13.08,36.02 12.24,36.85 12.19,36.85 R8.1 12.19,37.34 11.86,37.67 11.86,38.25 12.22,38.61 12.57,38.61 12.7,38.61 12.95,38.61 14.1,37.47 16.51,37.47 17.4,38.35 17.4,41.91 19.05,43.56 JP2.17
  $GND 0.203: v15.75,15.37 15.75,15.88 16.38,16.51 16.38,20.45 16.89,20.95 16.89,21.72 16.51,22.1 16.51,31.11 17.4,32 17.4,41.91 19.05,43.56 JP2.17
  Bottom 0.203: U3.7 7.16,21.34 7.37,21.34 8.76,19.94 9.27,19.94 10.41,18.8 10.79,18.8 11.81,17.78 11.81,16.13 12.06,15.88 15.24,15.88 v15.75,15.37
+3V3  (via drill 0.3)
  Top 0.203: R8.2 12.14,36.02 v11.18,36.02
  Top 0.305: v8.46,33.81 8.46,33.98 8.64,34.16 9.24,34.16 LED2.CA | R21.2 17.12,43.46 v16.46,42.8 16.46,41.92 R22.2
  Bottom 0.203: C30.1 17.27,29.59 17.53,29.34 17.53,27.46 U3.48 16.35,26.29 14.99,26.29 14.73,26.54 13.97,26.54 13.21,25.78 v12.27,25.78 | U2.5 15.33,35.21 U2.4 U2.3 | U2.3 16.43,35.61 C19.1 | v14.73,35.81 14.93,35.61 U2.3 | v11.18,36.02 11.18,35.94 11.5,35.61 U8.3 12.75,35.61 C18.1 | C20.1 C37.1 3.94,22.36 U3.13 5.17,23.6 5.71,23.6 6.12,23.19 6.68,23.19 v7.24,23.75 | U3.19 3.05,28.62 v3.05,29.72 3.66,30.33 C17.1 | 5.08,35.94 6.6,35.94 6.87,36.21 U5.5 | v10.79,19.56 10.79,19.46 U3.64 11.57,18.65 12.19,18.03 12.19,17.63 C31.1 | C8.1 5.08,37.24 5.08,35.94 | 5.08,35.94 4.83,35.94 4.57,36.2 4.57,36.75 U6.5 4.26,36.76 3.68,37.34 C9.1 | 9.12,33.81 9.12,34.57 | 9.12,33.81 v8.46,33.81 | U3.32 9.12,32.49 9.12,33.81
  Bottom 0.305: v7.37,36.96 6.87,36.96 U5.5
  Bottom 0.406: R3.2 R15.2 R16.2 | 11.81,39.78 R16.2 | v11.84,39.04 11.84,39.78 R16.2 | R13.2 R14.2 14.96,42.8 v16.46,42.8 | C36.1 9.12,34.57 C29.1
  Bottom 0.61: v7.24,23.75 v11.56,23.75
  other vias: 7.37,38.99 5.46,39.12
  pour $+3V3 (no thermals): 2.92,38.99 3.3,39.37 10.41,39.37 11.94,40.89 14.86,40.89 15.49,41.53 15.49,43.69 18.03,46.23 18.03,47.5 18.54,48.01 19.3,48.01 19.68,47.62 19.68,46.35 17.4,44.07 17.4,35.43 17.4,27.3 14.61,24.51 14.61,21.21 12.32,18.92 10.92,18.92 7.49,22.35 5.71,22.35 2.54,25.53 2.54,30.48 2.92,30.86
  pour Top (rank 2, no thermals): 4.32,40.89 4.83,40.89 5.21,41.27 5.97,41.27 6.35,40.89 6.35,40.13 6.6,39.88 7.62,39.88 7.87,39.62 7.87,36.07 7.62,35.81 5.46,35.81 5.21,36.07 5.21,39.88 4.83,40.26 4.45,40.26 4.32,40.39
+3V8  (via drill 0.3)
  Top 0.305: RED_LED_0603.A 8.64,39.76 8.64,38.86 9.27,38.23 v9.4,38.23
  $GND 1.778: v3.17,4.32 v3.17,5.08 3.94,5.84 3.94,27.56 5.08,28.7 5.08,30.73 3.94,31.88 v3.94,45.36
  $+3V3 0.305: v9.4,38.23 9.27,38.23 3.94,43.56 v3.94,45.36
  other vias: 3.94,45.92 3.53,45.64 4.34,45.64 3.43,4.7 2.92,4.7
  pour Bottom (no thermals): 2.79,8.38 5.59,8.38 5.59,5.59 3.94,3.94 2.79,3.94
  pour Top (no thermals): 2.41,8.89 3.94,8.89 3.94,4.45 3.3,3.81 3.3,0.25 2.67,0.25 2.67,4.19 2.41,4.45
  pour Bottom (no thermals): 8.53,43.94 8.53,43.69 8.26,43.69 7.49,43.69 6.25,42.44 5.44,42.44 5.44,43.81 5.44,44.83 5.13,45.14 3.1,45.14 2.92,45.31 2.92,46.81 3.12,47.02 7.04,47.02 7.11,46.94 7.11,44.6 7.49,44.22 8.53,44.22
  pour Top (no thermals): 4.45,42.42 3.68,42.42 3.68,42.93 3.43,43.18 3.43,45.72 3.81,46.1 4.32,46.1 4.7,45.72 4.7,43.05 4.57,42.93 4.57,42.42
A0  (via drill 0.3)
  $+3V3 0.203: v8.15,26.59 8.38,26.36 8.38,23.11 7.62,22.35 5.46,22.35 2.16,19.05 JP1.12
  Bottom 0.203: U3.25 6.99,28.93 6.99,27.43 7.82,26.59 v8.15,26.59
A1
  Bottom 0.203: U3.11 4.57,21.58 4.57,19.3 4.32,19.05 2.67,19.05 2.41,19.3 2.41,19.56 1.27,20.7 JP1.11
A2
  Bottom 0.203: JP1.10 2.92,24.13 4.32,25.53 7.37,25.53 8.51,24.38 11.81,24.38 12.19,24 12.19,23.5 11.81,23.11 8.38,23.11 7.62,22.35 6.05,22.35 U3.10
A3
  Bottom 0.203: U3.21 4.32,28.77 4.32,31.62 4.06,31.88 3.3,31.88 2.79,31.37 2.79,31.11 2.41,30.73 2.41,28.7 1.27,27.56 JP1.9
A4
  Bottom 0.203: U3.22 4.7,29.09 4.7,31.75 4.19,32.26 3.17,32.26 2.41,31.5 2.41,31.24 1.27,30.1 JP1.8
A5
  Bottom 0.203: U3.23 5.08,29.42 5.08,31.88 4.32,32.64 3.05,32.64 2.16,31.75 JP1.7
ANT
  Top 0.33: U1.56 J2.1
  Top 0.61: J2.1
B0  (via drill 0.3)
  $+3V3 0.203: v10.11,26.67 9.91,26.47 9.91,22.61 8.13,20.83 5.97,20.83 3.68,18.54 3.68,6.6 1.27,4.19 JP1.18
  Bottom 0.203: U3.39 10.37,26.67 v10.11,26.67
B1  (via drill 0.3)
  $+3V3 0.203: v10.16,27.56 9.53,26.92 9.53,22.73 8,21.21 5.84,21.21 3.3,18.67 3.3,8.38 JP1.17
  Bottom 0.203: U3.37 12.32,30.03 12.32,29.21 10.67,27.56 v10.16,27.56
B2  (via drill 0.3)
  $+3V3 0.203: JP1.16 1.65,8.89 2.92,10.16 2.92,18.8 5.71,21.59 7.87,21.59 9.14,22.86 9.14,30.73 9.58,31.17 v10.67,31.17
  Bottom 0.203: U3.26 7.37,29.25 7.37,27.56 7.75,27.18 8.38,27.18 10.67,29.46 v10.67,31.17
B3  (via drill 0.3)
  $+3V3 0.203: JP1.15 2.54,12.7 2.54,18.92 5.59,21.97 7.75,21.97 8.76,22.99 8.76,27.08 v8.05,27.79
  Bottom 0.203: U3.27 8.05,29.28 v8.05,27.79
B4
  Bottom 0.203: U3.8 5.33,20.22 5.33,19.05 4.57,18.29 3.3,18.29 2.41,17.4 2.41,15.11 JP1.14
B5
  Bottom 0.203: JP1.13 1.27,17.02 2.92,18.67 4.45,18.67 4.95,19.18 4.95,20.55 U3.9
BAT  (via drill 0.3)
  Top 0.203: R23.2 10.5,42.29 8.51,42.29 8.28,42.52 7.14,42.52 v6.93,42.32
  other vias: 6.65,41.94 7.21,41.94
  pour Bottom (rank 3, no thermals): 8.53,43.21 8.53,42.7 7.72,42.7 7.42,42.39 7.42,41.78 7.32,41.68 7.04,41.68 6.38,41.02 5.44,41.02 5.44,41.99 6.35,41.99 7.57,43.21
  pour Top (rank 3, no thermals): 5.08,48.39 6.35,48.39 6.35,43.18 7.42,42.11 7.42,42.01 7.42,41.78 7.34,41.71 6.55,41.71 5.97,42.29 5.46,42.29 5.08,42.67
BTST
  Bottom 0.254: U$1.21 9.91,46.35 9.6,46.66 8.33,46.66 8,46.99 8,47.78 C7.1
C0  (via drill 0.3)
  $+3V3 0.203: v13.08,22.61 14.1,22.61 14.48,22.23 14.48,20.83 16.64,18.67 16.64,6.22 JP2.1
  Bottom 0.203: U3.54 14.6,22.73 13.84,22.73 13.72,22.61 v13.08,22.61
C1  (via drill 0.3)
  $+3V3 0.203: v13.59,23.24 13.97,23.24 14.86,22.35 14.86,20.95 17.02,18.8 17.02,8.38 JP2.2
  Bottom 0.203: U3.53 14.79,23.24 v13.59,23.24
C2  (via drill 0.3)
  $+3V3 0.203: v13.59,24.26 13.59,24.13 15.24,22.48 15.24,21.08 17.4,18.92 17.4,10.54 JP2.3
  Bottom 0.203: U3.52 15.12,23.62 14.1,23.62 13.59,24.13 v13.59,24.26
C3  (via drill 0.3)
  $+3V3 0.203: v15.88,21.34 15.88,20.95 17.78,19.05 17.78,12.7 JP2.4
  Bottom 0.203: U3.51 16.76,22.68 16.76,22.23 v15.88,21.34
C4
  Bottom 0.203: U3.62 14.4,17.27 15.11,17.27 18.41,13.97 JP2.5
C5
  Bottom 0.203: U3.61 13.84,18.54 16.38,18.54 18.41,16.51 JP2.6
CTS_UB  (via drill 0.3)
  Top 0.203: U1.11 14.35,17.27 13.97,17.65 13.97,19.18 12.57,20.57 11.81,20.57 v11.3,21.08
  $GND 0.203: v11.3,21.08 11.43,21.21 11.43,21.97 10.67,22.73 10.67,25.4 11.56,26.29 11.56,28.45 12.95,29.84 12.95,32.77 13.84,33.66 13.84,35.31 11.3,37.85 v11.3,38.3
  Bottom 0.203: U8.15 11.38,38.23 v11.3,38.3
CTS_UC
  Bottom 0.203: U3.34 12.45,32.28 12.45,32.64 11.94,33.15 11.68,33.15 11.3,33.53 11.3,34.04 11.38,34.11 U8.6
D0
  Bottom 0.203: U3.59 14.74,19.05 JP2.7
D1
  Bottom 0.203: U3.58 14.94,19.56 16.38,19.56 18.41,21.59 JP2.8
D2
  Bottom 0.203: U3.57 15.14,20.07 16.26,20.07 17.78,21.59 17.78,22.86 JP2.9
D3
  Bottom 0.203: U3.56 15.34,20.57 16.13,20.57 17.4,21.84 17.4,22.99 17.78,23.37 17.78,25.65 18.8,26.67 JP2.10
D4
  Bottom 0.203: U3.55 14.27,22.35 13.97,22.35 13.59,21.97 12.83,21.97 12.45,22.35 12.45,22.86 12.95,23.37 12.95,25.02 14.1,26.16 14.61,26.16 14.86,25.91 16.64,25.91 17.91,27.18 17.91,28.32 18.8,29.21 JP2.11
D5  (via drill 0.3)
  $+3V3 0.203: v14.35,24.26 15.24,25.15 16.76,25.15 17.78,26.16 17.78,30.73 18.8,31.75 JP2.12
  Bottom 0.203: U3.50 15.9,24.26 v14.35,24.26
D6  (via drill 0.3)
  $+3V3 0.203: v14.35,25.53 16.64,25.53 17.4,26.29 17.4,30.86 17.78,31.24 17.78,33.27 18.8,34.29 JP2.13
  Bottom 0.203: U3.49 15.34,25.53 v14.35,25.53
D7  (via drill 0.3)
  Top 0.203: R10.2 13.97,35.69 14.48,35.18 14.99,35.18 15.62,35.81 18.03,35.81 JP2.14
  $+3V3 0.203: v14.35,27.18 14.35,26.42 14.86,25.91 16.51,25.91 17.02,26.42 17.02,30.99 17.4,31.37 17.4,35.43 18.8,36.83 JP2.14
  Bottom 0.203: U3.46 15.57,26.92 14.61,26.92 v14.35,27.18
DAC  (via drill 0.3)
  $+3V3 0.203: JP1.6 2.92,32.64 2.92,31.37 3.94,30.35 3.94,29.46 v3.68,29.21
  Bottom 0.203: U3.20 3.68,28.7 v3.68,29.21
GND  (via drill 0.3)
  Top 0.254: 14.99,24.26 15.32,23.92 U1.83
  Top 0.406: C16.2 C15.2 C1.2 C2.2 | U1.64 15.66,5.37 16.51,6.22 17.06,6.22 U1.1 | U1.3 15.76,8.47 U1.71 | U1.14 15.66,20.57 U1.81
  Bottom 0.178: 11.78,35.21 11.19,35.21 10.79,35.61 U8.10 | U2.10 13.49,35.61 13.39,35.51 13.39,35.13 C18.2
  Bottom 0.203: C28.2 C26.2 | C34.2 C33.2 | U3.60 12.51,20.57 12.19,20.57 11.43,19.81 11.43,19.56 11.93,19.06 U3.63 | U8.11 U8.10 | 17.91,38.23 17.91,32.13 17.27,31.5 C30.2 C32.2 | C19.2 15.98,34.04 15.49,34.04 14.35,32.89 v13.97,32.89 | U8.5 11.78,35.21 U8.4
  other vias: 2.97,30.48 1.78,22.86 9.09,16.23 5.46,13.08 7.24,13.34 11.43,14.48 16.38,38.99 9.93,37.06 2.03,2.54 2.03,0.76 4.7,3.94 14.22,3.94 7.87,3.94 9.78,3.94 5.84,3.94 12.57,3.94 11.43,3.94 16.89,3.94 18.67,2.54 18.67,0.76 15.49,3.94 1.91,10.16 5.97,8.89 12.27,6.99 15.62,11.94 14.35,8.76 5.97,9.78 5.46,17.78 5.92,19.79 7.37,22.99 12.24,26.62 18.54,27.94 18.54,20.32 18.54,15.24 14.35,6.99 10.16,6.6 11.81,22.48 12.42,38 7.49,24.51 5.33,33.91 1.78,25.4 12.57,13.97 15.62,13.21 18.67,1.78 2.03,1.65 2.54,40.89 8,41.86 11.07,39.04 12.75,18.08 9.78,30.43 11.56,30.43 2.54,41.66 18.08,43.46 9.19,2.16 5.84,3.17 7.87,3.17 9.19,2.92 4.5,2.16 4.5,2.92 4.5,1.4 4.5,0.64 12.19,3.05 14.22,3.05 2.54,42.42
  pour $+3V3 (rank 4, no thermals): 0,50.8 20.32,50.8 20.32,2.54 19.05,0 1.27,0 0,2.54
  pour Top (rank 4, no thermals): 0,50.8 20.32,50.8 20.32,2.54 19.05,0 1.27,0 0,2.54
  pour Bottom (rank 4, no thermals): 0,50.8 20.32,50.8 20.32,2.54 19.05,0 1.27,0 0,2.54
  pour $GND (rank 4, no thermals): 0,50.8 20.32,50.8 20.32,2.54 19.05,0 1.27,0 0,2.54
ILIM
  Bottom 0.254: R2.1 9.65,41.02 9.91,41.27 U$1.10
LED1
  Top 0.305: R10.1 15.02,36.93 BLUE_LED_0603.A
N$1
  Bottom 0.254: R20.2 6.99,40.89 7.37,41.27 8.51,41.27 8.91,41.68 U$1.12
N$2
  Bottom 0.254: R7.1 13.84,43.81 13.36,44.3 12.75,44.3 12.64,44.19 U$1.3
N$4
  cutout $GND: 11.71,47.18 arc-90 12.4,47.87 12.41,47.87 arc-91 13.09,47.18 arc-88 12.4,46.49 arc-92
N$6
  Top 0.305: RED_LED_0603.C 9.03,41.66 9.65,41.66 9.91,41.4 R4.2
N$7
  Bottom 0.254: U$1.8 10.91,41.41 11.43,40.89 R16.1
N$9
  Bottom 0.254: U$1.7 11.75,41.97 12.32,41.4 R15.1
N$10
  cutout Top: 5.97,2.41 7.75,2.41 7.75,0.51 5.97,0.51
N$11
  Top 0.305: R23.1 11.32,39.78 C39.1 14.38,39.78 14.61,40.01 U4.2
N$12
  Top 0.305: U4.3 15.11,40.01 15.37,39.75 15.6,39.75 C38.1 16.32,39.73 R22.1
N$15
  Bottom 0.203: U3.31 7.77,32.38 C35.1
N$16
  Bottom 0.203: U3.47 17.02,27.66 17.02,29.21 16.38,29.84 C32.1
N$17
  cutout $GND: 15.61,47.18 arc-90 16.3,47.87 16.31,47.87 arc-91 16.99,47.18 arc-88 16.3,46.49 arc-92
N$18
  cutout $+3V3: 11.71,47.18 arc-90 12.4,47.87 12.41,47.87 arc-91 13.09,47.18 arc-88 12.4,46.49 arc-92
N$19
  cutout $+3V3: 15.61,47.18 arc-90 16.3,47.87 16.31,47.87 arc-91 16.99,47.18 arc-88 16.3,46.49 arc-92
N$20
  cutout Bottom: 11.71,47.18 arc-90 12.4,47.87 12.41,47.87 arc-91 13.09,47.18 arc-88 12.4,46.49 arc-92
N$21
  cutout Bottom: 15.61,47.18 arc-90 16.3,47.87 16.31,47.87 arc-91 16.99,47.18 arc-88 16.3,46.49 arc-92
N$22
  cutout $+3V3: 10.96,48.7 10.96,49.86 arc-90 11.62,50.39 11.63,50.39 arc-90 12.19,49.83 12.19,48.74 arc-90 11.66,48.16 arc-90
  cutout $+3V3: 16.51,48.7 16.51,49.83 arc-90 17.07,50.39 17.08,50.39 arc-90 17.74,49.81 17.74,48.74 arc-90 17.01,48.16 arc-90
N$27
  Top 0.203: LED2.BLUE 10.01,35.23 R11.1
N$29
  Top 0.203: R9.1 10.01,32.49 10.75,33.23 LED2.GREEN
N$54
  Top 0.203: LED2.RED 9.23,33.23 8.23,32.23 R12.1
OSC32_IN_UC
  Bottom 0.203: Y1.X1 10.14,16.24 10.39,16.48 C34.1 10.39,17.42 10.16,17.65 8.13,17.65 7.59,18.19 7.59,18.95 U3.3
OSC32_OUT_UC
  Bottom 0.203: Y1.X2 7.64,16.24 7.39,16.48 C33.1 7.49,17.12 7.49,17.78 7.24,18.03 7.24,19.3 U3.4
OSC_IN_UC
  Bottom 0.203: Y2.1 5.71,16.13 6.07,16.48 C28.1 6.17,17.12 6.17,18.11 6.86,18.8 6.86,19.62 U3.5
OSC_OUT_UC
  Bottom 0.203: Y2.3 3.43,12.95 4.32,13.84 4.32,16.13 4.06,16.38 3.3,16.38 3.07,16.61 C26.1 3.07,17.42 3.56,17.91 4.7,17.91 5.33,18.54 6.1,18.54 6.48,18.92 6.48,19.95 U3.6
PA8_PM_SCL  (via drill 0.3)
  Top 0.203: U4.7 14.61,43.94 14.43,44.12 13.77,44.12 13.59,43.94 13.59,43.46 13.06,42.93 v13.03,42.93
  $+3V3 0.203: v13.03,42.93 14.1,41.86 14.1,41.02 13.34,40.26 13.34,38.89 13.77,38.46 13.77,35.89 15.24,34.42 v15.24,32.77
  Bottom 0.203: U3.41 14.99,29.87 14.99,32.13 15.24,32.38 v15.24,32.77
  Bottom 0.254: U$1.5 12.69,43.19 12.95,42.93 v13.03,42.93 R14.1
PC9_PM_SDA  (via drill 0.3)
  Top 0.203: U4.8 14.07,43.44 13.61,42.98 13.61,42.67 13.11,42.16 v12.75,42.16
  $+3V3 0.203: v14.4,32.21 14.61,32.41 14.61,34.54 13.39,35.76 13.39,38.33 12.95,38.76 12.95,40.39 13.72,41.15 13.72,41.66 13.21,42.16 v12.75,42.16
  Bottom 0.203: U3.40 14.61,30.2 14.61,32 v14.4,32.21
  Bottom 0.254: U$1.6 12.13,42.35 12.32,42.16 v12.75,42.16 13.74,42.16 R13.1
PMID
  Bottom 0.254: U$1.23 10.91,46.88 10.29,47.5 C5.1
PWR_UB  (via drill 0.3)
  Top 0.203: U1.15 16.81,21.97 15.62,21.97 15.24,21.59 12.57,21.59 12.32,21.84 11.56,21.84 11.05,22.35 10.54,22.35 9.65,21.46 v9.65,20.83
  $GND 0.203: v9.2,37.39 9.27,37.31 9.27,34.92 9.78,34.42 9.78,33.27 9.14,32.64 9.14,30.23 9.53,29.84 9.53,20.95 v9.65,20.83
  Bottom 0.203: v9.2,37.39 8.33,37.39 8.1,37.62 6.22,37.62 R1.1 6.22,36.96 6.03,36.76 U5.4
PWR_UC
  Bottom 0.203: U3.28 6.86,31.18 6.86,32.51 6.22,33.15 U5.2
REGN  (via drill 0.3)
  $+3V3 0.254: v9.32,39.06 9.32,41.6 8.26,42.67 8.26,46.86 v8.64,47.24
  Bottom 0.254: R18.1 7.87,39.7 8.51,39.06 v9.32,39.06 | U$1.22 10.41,46.61 9.78,47.24 v8.64,47.24
  Bottom 0.406: v8.64,47.24 8.64,47.89 C25.1
RESET_UB  (via drill 0.3)
  Top 0.203: U1.18 17.03,24.89 11.81,24.89 10.79,23.88 10.79,23.11 8.89,21.21 v8.89,20.7
  $GND 0.203: v8.69,36.73 8.64,36.68 8.64,35.05 9.4,34.29 9.4,33.4 8.76,32.77 8.76,30.1 9.14,29.72 9.14,21.08 8.89,20.83 v8.89,20.7
  Bottom 0.203: v8.69,36.73 8.15,36.2 7.49,36.2 6.86,35.56 6.6,35.56 6.48,35.56 3.81,35.56 3.29,36.08 U6.4
RESET_UC
  Bottom 0.203: U3.24 5.46,29.75 5.46,32 3.94,33.53 U6.2
RGB_BLUE  (via drill 0.3)
  Top 0.203: R11.2 8.28,35.18 6.73,35.18 6.48,34.92 6.48,33.15 v5.84,32.51
  $+3V3 0.203: v5.97,26.16 6.1,26.16 6.6,26.67 6.6,30.48 5.59,31.5 5.59,32.26 v5.84,32.51
  Bottom 0.203: U3.17 4.09,26.16 v5.97,26.16
RGB_GREEN  (via drill 0.3)
  Top 0.203: R9.2 9.04,31.52 8.51,30.99 6.1,30.99 5.21,31.88 5.21,33.02 v5.33,33.15
  $+3V3 0.203: v6.73,24.51 6.73,25.53 7.37,26.16 7.37,31.88 6.1,33.15 v5.33,33.15
  Bottom 0.203: U3.16 4.6,25.15 6.22,25.15 6.73,24.64 v6.73,24.51
RGB_RED  (via drill 0.3)
  Top 0.203: R12.2 6.35,31.62 v6.22,31.75
  $+3V3 0.203: v5.97,24.51 5.97,25.27 6.99,26.29 6.99,30.99 v6.22,31.75
  Bottom 0.203: U3.15 4.67,24.51 v5.97,24.51
RI_UB  (via drill 0.3)
  Top 0.203: v10.79,21.72 10.67,21.59 10.67,20.83 11.56,19.94 12.7,19.94 13.59,19.05 13.59,17.53 13.97,17.14 13.97,13.84 15.24,12.57 16.81,12.57 U1.7
  $GND 0.203: 10.54,21.97 v10.79,21.72 10.29,22.23 10.29,25.53 11.18,26.42 11.18,28.57 12.57,29.97 12.57,32.89 13.46,33.78 13.46,35.18 10.67,37.97 10.67,38.35 v10.54,38.48
  Bottom 0.203: U8.14 10.98,37.66 10.67,37.97 10.67,38.35 v10.54,38.48
RI_UC
  Bottom 0.203: U8.7 10.98,34.19 10.9,34.11 10.9,32.92 11.57,32.24 U3.33
RTS_UB  (via drill 0.3)
  Top 0.203: v14.61,16.64 14.99,16.26 17.03,16.26 U1.10
  $GND 0.203: v14.61,16.64 14.61,16.89 15.24,17.53 15.24,20.57 14.86,20.95 14.86,21.72 15.37,22.23 15.37,31.5 16.26,32.38 16.26,36.58 15.37,37.47 15.37,38.23 v14.86,38.73
  Bottom 0.203: U2.15 14.93,38.66 v14.86,38.73
RTS_UC
  Bottom 0.203: U2.6 14.93,34.11 14.35,33.53 13.21,33.53 12.83,33.15 12.83,31.96 U3.35
RX  (via drill 0.3)
  $+3V3 0.203: JP1.4 2.54,38.1 2.54,36.07 2.92,35.69 2.92,33.66 3.68,32.89 3.68,31.62 4.7,30.61 4.7,27.69 5.46,26.92 v5.97,26.92
  Bottom 0.203: U3.43 14.34,27.81 12.57,27.81 10.41,25.65 7.75,25.65 6.48,26.92 v5.97,26.92
RXD_UB  (via drill 0.3)
  Top 0.203: U1.13 16.94,19.3 14.35,19.3 12.45,21.21 v12.06,21.21
  $GND 0.203: v12.06,21.21 12.06,20.95 11.56,20.45 11.05,20.45 9.91,21.59 9.91,25.65 10.79,26.54 10.79,28.7 12.19,30.1 12.19,33.02 13.08,33.91 13.08,35.05 10.29,37.85 v10.08,37.85
  Bottom 0.203: U8.13 10.58,37.35 v10.08,37.85
RXD_UC
  Bottom 0.203: U3.30 8.59,30.86 8.89,30.86 10.16,32.13 10.16,33.91 10.58,34.33 U8.8
SIM_CLK  (via drill 0.3)
  Top 0.203: U1.38 5.17,22.77 7.75,20.19 7.75,14.86 11.43,11.18 11.43,10.54 10.92,10.03 v10.03,10.03
  Top 0.406: v15.62,1.02 15.24,1.4 C12.1
  Bottom 0.305: v10.03,10.03 10.03,7.75 13.34,4.45 13.34,1.78 13.84,1.27 14.19,1.27 J1.C3 14.44,1.02
  Bottom 0.406: J1.C3 15.59,0.98 v15.62,1.02
SIM_IO  (via drill 0.3)
  Top 0.203: U1.39 5.76,21.67 7.37,20.07 7.37,14.73 10.67,11.43 v10.67,11.05
  Bottom 0.305: v10.67,11.05 10.67,10.29 11.18,9.78 12.7,9.78 13.21,10.29 13.21,12.19 13.59,12.57 14.47,12.57 J1.C7
  Bottom 0.406: C13.1 14.45,12.61 J1.C7
SIM_RST  (via drill 0.3)
  Top 0.203: U1.40 3.68,20.57 4.32,21.21 5.71,21.21 6.99,19.94 6.99,14.61 8.76,12.83 v8.76,10.03
  Top 0.406: v13.08,1.02 13.21,1.14 C10.1
  Bottom 0.305: v8.76,10.03 8.76,6.48 10.67,4.57 10.67,1.91 11.3,1.27 11.65,1.27 J1.C2 11.9,1.02
  Bottom 0.406: J1.C2 13.05,0.98 v13.08,1.02
SIM_VCC  (via drill 0.3)
  Top 0.406: C11.1 10.67,2.06 | 10.67,2.06 C14.1 | U1.41 3.38,19.3 5.33,19.3 6.35,18.29 6.35,10.54 6.86,10.03 v7.49,10.03 | v10.54,1.02 10.67,1.14 10.67,2.06
  Bottom 0.406: J1.C6 11.94,13.34 11.68,13.59 8.64,13.59 8.26,13.21 8.26,10.79 v7.49,10.03 7.49,5.33 8.53,4.29 8.53,1.75 9.27,1.02 9.36,1.02 J1.C1 10.51,0.98 v10.54,1.02
STAT  (via drill 0.3)
  Top 0.305: R4.1 9.91,39.27 v10.08,39.09
  $+3V3 0.254: v13.03,43.69 12.95,43.69 12.06,42.8 12.06,41.07 v10.08,39.09
  Bottom 0.254: U$1.4 v13.03,43.69
SW1
  pour Bottom (rank 2, no thermals): 9.14,45.57 7.57,45.57 7.44,45.69 7.44,47.04 7.16,47.32 6.25,48.23 4.57,48.23 3.12,48.23 2.92,48.44 2.92,49.91 3.12,50.11 7.19,50.11 8,49.3 8,46.69 8.41,46.28 9.42,46.28 9.42,45.57
SW2
  pour Top (rank 3, no thermals): 3.05,40.89 3.3,40.89 3.3,40.39 3.3,40.13 3.56,39.88 4.57,39.88 4.7,39.75 4.7,35.94 4.57,35.81 2.79,35.81 2.67,35.94 2.67,39.75 3.05,40.13
TS
  Bottom 0.203: R20.1 6.99,39.83 7.87,40.72 R18.2
  Bottom 0.254: U$1.11 9.41,41.54 8.76,40.89 R19.1 R18.2
TX  (via drill 0.3)
  $+3V3 0.203: v5.97,27.69 5.71,27.69 5.08,28.32 5.08,30.73 4.06,31.75 4.06,33.02 3.3,33.78 3.3,35.81 2.92,36.2 2.92,38.23 2.54,38.61 2.54,39.88 1.27,41.15 JP1.3
  Bottom 0.203: U3.42 14.02,28.19 12.45,28.19 10.29,26.04 7.87,26.04 6.22,27.69 v5.97,27.69
TXD_UB  (via drill 0.3)
  Top 0.203: U1.12 15.07,18.37 v14.61,17.91
  $GND 0.203: v14.61,17.91 14.86,18.16 14.86,20.45 14.48,20.83 14.48,21.84 14.99,22.35 14.99,31.62 15.88,32.51 15.88,36.45 14.35,37.97 v14.35,38.1
  Bottom 0.203: U2.14 14.53,37.92 v14.35,38.1
TXD_UC  (via drill 0.3)
  $+3V3 0.203: v11.89,33.78 10.72,32.61 v10.72,32.28
  Bottom 0.203: U2.7 14.53,34.22 14.22,33.91 12.01,33.91 v11.89,33.78 | U3.29 8.26,30.48 9.02,30.48 10.72,32.18 v10.72,32.28
USB_DM
  Top 0.406: X1.D- 15,45.2 U$7.P$2
  Bottom 0.203: R6.2 16.38,33.91 16.51,34.04 16.89,34.04 17.14,34.29 17.14,43.56 15.75,44.96 U$7.P$2
  Bottom 0.254: R7.2 15.24,44.22 U$7.P$2
USB_DM_UC
  Bottom 0.203: U3.44 16,28.77 16,28.96 15.37,29.59 15.37,32 15.9,32.54 R6.1
USB_DP
  Top 0.406: X1.D+ 14.35,45.34 U$7.P$1
  Bottom 0.203: R5.2 17.27,33.78 17.53,34.04 17.53,43.94 15.62,45.85 14.86,45.85 U$7.P$1
  Bottom 0.254: U$1.2 12.56,44.69 12.83,44.96 U$7.P$1
USB_DP_UC
  Bottom 0.203: U3.45 16.51,28.57 16.51,29.08 15.75,29.84 15.75,31.75 16,32 17.02,32 17.27,32.26 R5.1
V_BCKP  (via drill 0.3)
  Top 0.203: U1.2 16.63,7.37 16.13,7.87 12.57,7.87 12.19,8.26 12.19,10.92 10.03,13.08 v10.03,20.07
  $GND 0.203: v10.03,20.07 8.64,20.07 8.26,20.45 8.26,20.95 8.76,21.46 8.76,29.59 8.38,29.97 8.38,32.64 7.75,33.27 7.75,34.67 8.1,35.03 8.1,37.44 v8.64,37.97
  Bottom 0.203: R1.2 6.96,37.97 v8.64,37.97
V_INT  (via drill 0.3)
  Top 0.203: U1.4 17.03,9.65 14.73,9.65 13.59,10.79 13.59,16.38 v13.34,16.64
  $GND 0.203: v13.34,16.64 13.97,16 14.86,16 15.62,16.76 15.62,20.7 15.24,21.08 15.24,21.59 15.75,22.1 15.75,31.37 16.64,32.26 16.64,36.7 16.13,37.21 v16.13,38.1 16.13,38.35 15.11,39.37 14.55,39.37 v14.1,38.91
  Bottom 0.178: C21.1 12.78,36.35 12.44,36.01 U8.2
  Bottom 0.203: C22.1 16.41,36.35 | 16.41,36.35 16.07,36.01 U2.2 | 16.41,36.35 15.88,36.88 15.88,37.85 v16.13,38.1 | C21.1 12.85,36.35 13.46,36.96 13.46,38.28 v14.1,38.91
VBAT  (via drill 0.3)
  $GND 0.203: v12.83,14.86 13.08,14.61 15.88,14.61 16.38,15.11 16.38,16 16.76,16.38 16.76,20.32 17.27,20.83 17.27,21.84 16.89,22.23 16.89,30.99 17.78,31.88 17.78,40.64 JP2.16
  Bottom 0.203: U3.1 9.39,18.03 10.54,18.03 11.05,17.53 11.05,15.88 12.06,14.86 v12.83,14.86
VBUS  (via drill 0.3)
  Top 0.61: v17.02,45.97 17.17,46.13 17.17,47.19 19.05,49.07 JP3.1
  other vias: 16.38,45.97
  pour Top (rank 2, no thermals): 15.62,47.12 17.02,47.12 17.4,46.74 17.4,45.97 17.02,45.59 15.88,45.59 15.62,45.85
  pour Bottom (rank 2, no thermals): 14.48,46.86 17.27,46.86 17.53,46.61 17.53,45.85 17.27,45.59 16.38,45.59 15.75,46.23 14.48,46.23
VIN  (via drill 0.3)
  $+3V3 1.016: JP1.1 3.05,48.77 9.42,48.77 v12.39,45.8
  other vias: 12.01,46.1
  pour Bottom (rank 3, no thermals): 11.3,45.47 11.3,46.23 11.68,46.61 11.94,46.86 11.94,47.75 12.45,47.75 12.57,47.75 12.57,48.39 13.34,48.39 15.75,48.39 16.13,48.39 16.13,46.23 14.35,46.23 14.1,46.23 12.95,45.09 11.68,45.09 11.68,45.47
WKP  (via drill 0.3)
  $+3V3 0.203: JP1.5 2.54,35.56 2.54,33.53 3.3,32.77 3.3,31.5 4.32,30.48 4.32,27.56 5.33,26.54 5.33,24.21 5.79,23.75 v6.35,23.75
  Bottom 0.203: v6.35,23.75 6.15,23.95 4.82,23.95 U3.14

### Text on the board
tPlace: 011 | 5V | VIN | 3V3 | D+ | D- | GND | RST | TX | VBAT | RX | GND | WKP | D7 | DAC | D6 | SETUP | RESET | A5 | D5 | A4 | D4 | A3 | D3 | A2 | D2 | A1 | D1 | A0 | D0 | B5 | C5 | B4 | C4 | B3 | C3 | B2 | C2 | B1 | C1 | B0 | C0
tDocu: NOTES: / / Layer stack up: / 1 - GTL - Top Signal, GND / 2 - G2L - Inner Signal, GND, +3V8 / 15 - G15L - Inner Signal, GND, +3V3 / 16 - GBL - Bottom Signal, GND | Reference Designs ARE PROVIDED "AS IS" AND "WITH ALL FAULTS. PARTICLE INDUSTRIES, INC / ("PARTICLE") DISCLAIMS ALL OTHER WARRANTIES, EXPRESS OR IMPLIED, REGARDING / PRODUCTS OR THE REFERENCE DESIGNS, INCLUDING BUT NOT LIMITED TO, ANY / IMPLIED WARRANTIES OF MERCHANTABILITY, FITNESS FOR A PARTICULAR PURPOSE, / OR NON-INFRINGEMENT. / / Particle may make changes to specifications and product descriptions at any / time, without notice. The Customer must not rely on the absence or / characteristics of any features or instructions marked "reserved" or / "undefined." Particle reserves these for future definition and shall have / no responsibility whatsoever for conflicts or incompatibilities arising / from future changes to them. The product information on the Web Site or / Materials is subject to change without notice. Do not finalize a design / with this information. / Particle is a registered trademark.